# Altium project HUB_USB_3.0.PrjPcb (part 1 of 3)
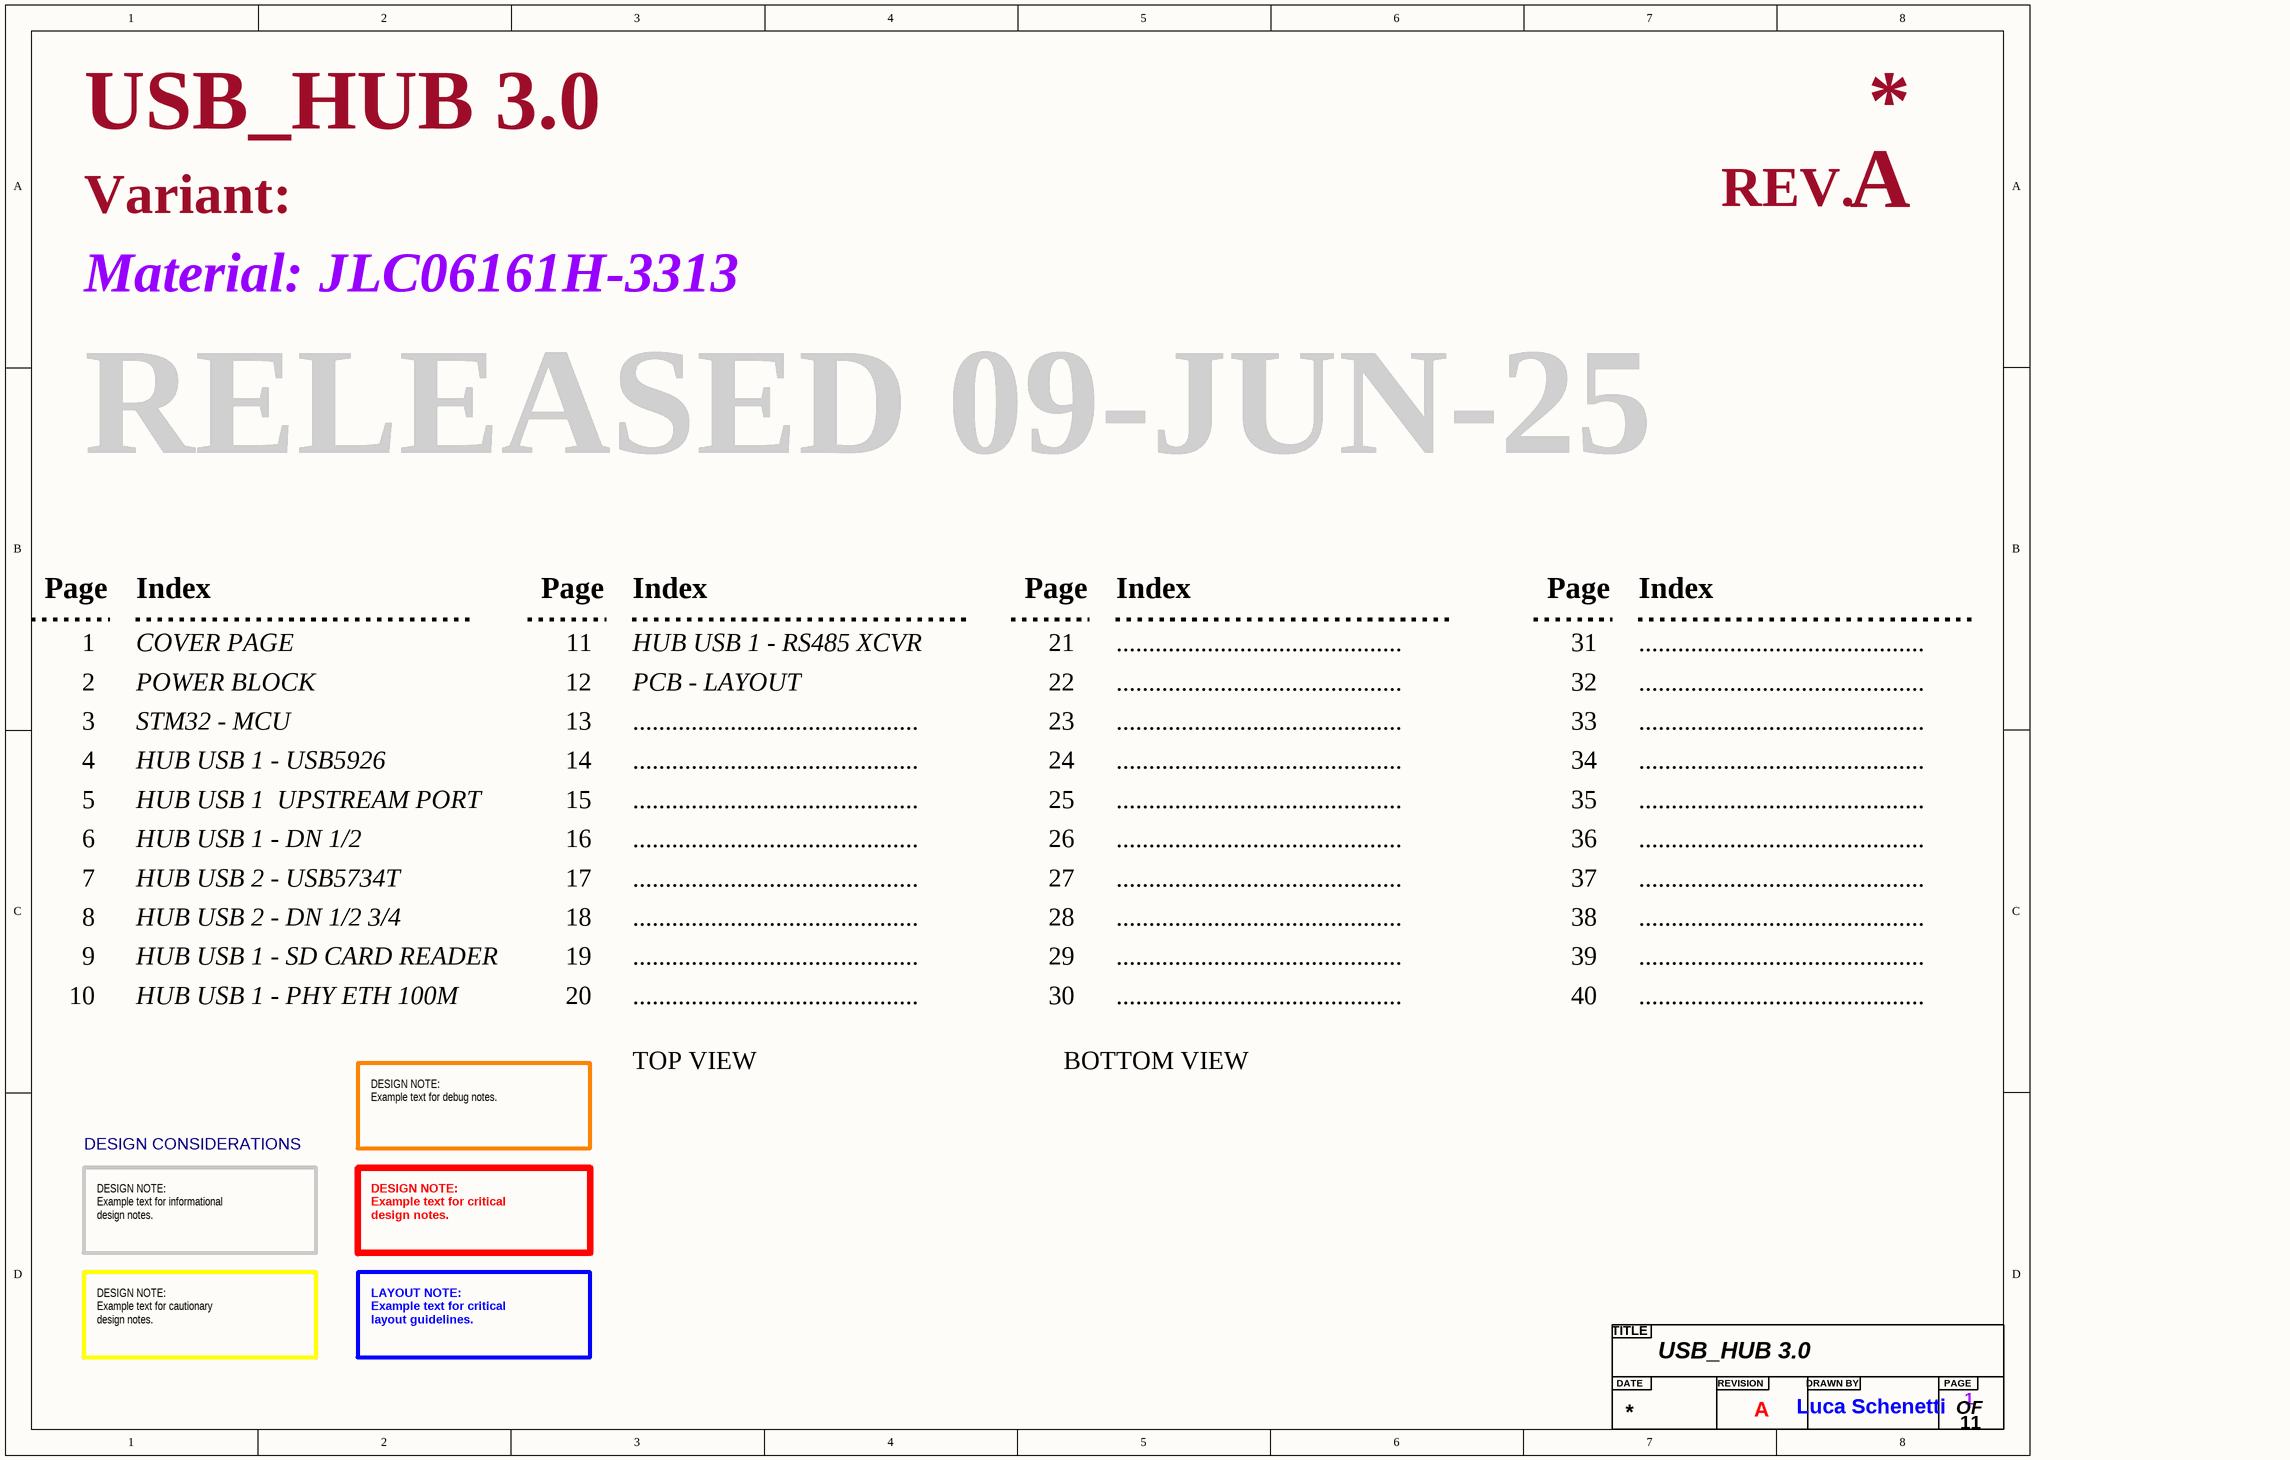
[diagram p0: COVER PAGE.SchDoc]
11 sheets, 545 parts. Net scope: flat (ports and power ports of the same name join across sheets).
Board file: PCB - LAYOUT.PcbDoc
Sheets:
  COVER PAGE.SchDoc
  PWR.SchDoc
  MCU.SchDoc
  USB_HUB1.SchDoc
  USB_HUB1 UP PORT0.SchDoc
  USB_HUB1 DN PORT 1_2.SchDoc
  USB_HUB1 DN PORT 3.SchDoc
  USB_HUB2 DN PORT.SchDoc
  USB_HUB1 DN PORT 4.SchDoc
  USB_HUB1 DN PORT 5.SchDoc
  USB_HUB1 DN PORT 6.SchDoc

## Sheet COVER PAGE.SchDoc: USB_HUB 3.0
size A3; DrawnBy: Luca Schenetti; Engineer: Luca Schenetti; Revision: A; SheetNumber: 1; SheetTotal: 11; Material: JLC06161H-3313

### Parts
(Parts that share a designator on the sheet are numbered #1, #2 ... from top to bottom, then left to right.)
?#1  Title  (value not drawn)  (graphical)

### Notes on the sheet
- Variant:
- REV.
- Material:
- RELEASED 09-JUN-25
- Page
- Index
- 1
- 2
- COVER PAGE
- POWER BLOCK
- 11
- 12
- PCB - LAYOUT
- HUB USB 1 - RS485 XCVR
- 21
- 22
- ............................................
- 31
- 32
- 3
- STM32 - MCU
- 13
- 23
- 33
- 4
- 5
- HUB USB 1 - USB5926
- HUB USB 1  UPSTREAM PORT
- 14
- 15
- 24
- 25
- 34
- 35
- 6
- 7
- HUB USB 2 - USB5734T
- HUB USB 1 - DN 1/2
- 16
- 17
- 26
- 27
- 36
- 37
- 8
- HUB USB 2 - DN 1/2 3/4
- 18
- 28
- 38
- 9
- 10
- HUB USB 1 - SD CARD READER
- HUB USB 1 - PHY ETH 100M
- 19
- 20
- 29
- 30
- 39
- 40
- TOP VIEW
- BOTTOM VIEW
- DESIGN CONSIDERATIONS
- DESIGN NOTE:
  Example text for debug notes.
- DESIGN NOTE:
  Example text for informational
  design notes.
- DESIGN NOTE:
  Example text for critical
  design notes.
- DESIGN NOTE:
  Example text for cautionary
  design notes.
- LAYOUT NOTE:
  Example text for critical
  layout guidelines.
- (in symbol Title) TITLE; DATE; REVISION; DRAWN BY; PAGE; OF

## Sheet PWR.SchDoc: USB_HUB 3.0
size A1; DrawnBy: Luca Schenetti; Revision: A; SheetNumber: 2; SheetTotal: 10
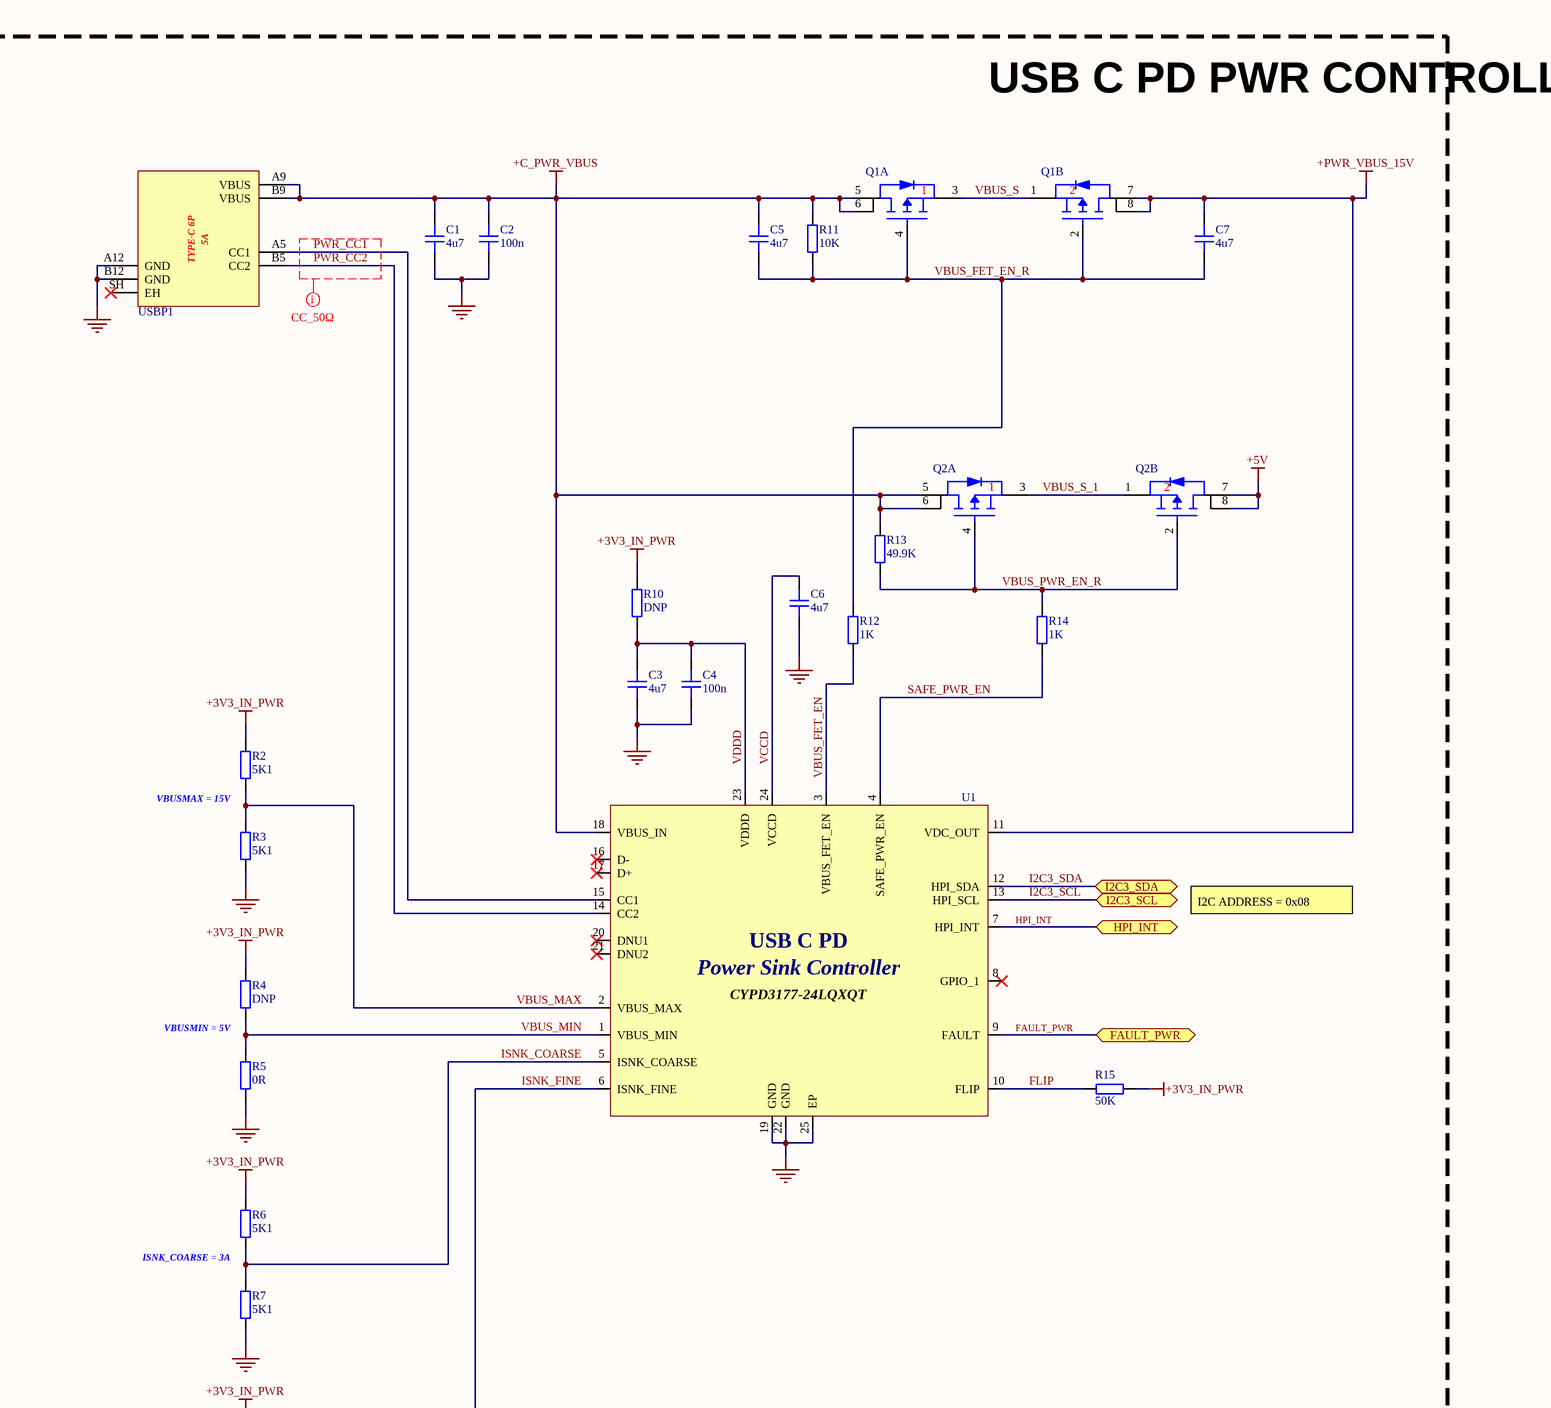
[diagram p1: PWR.SchDoc, top left]
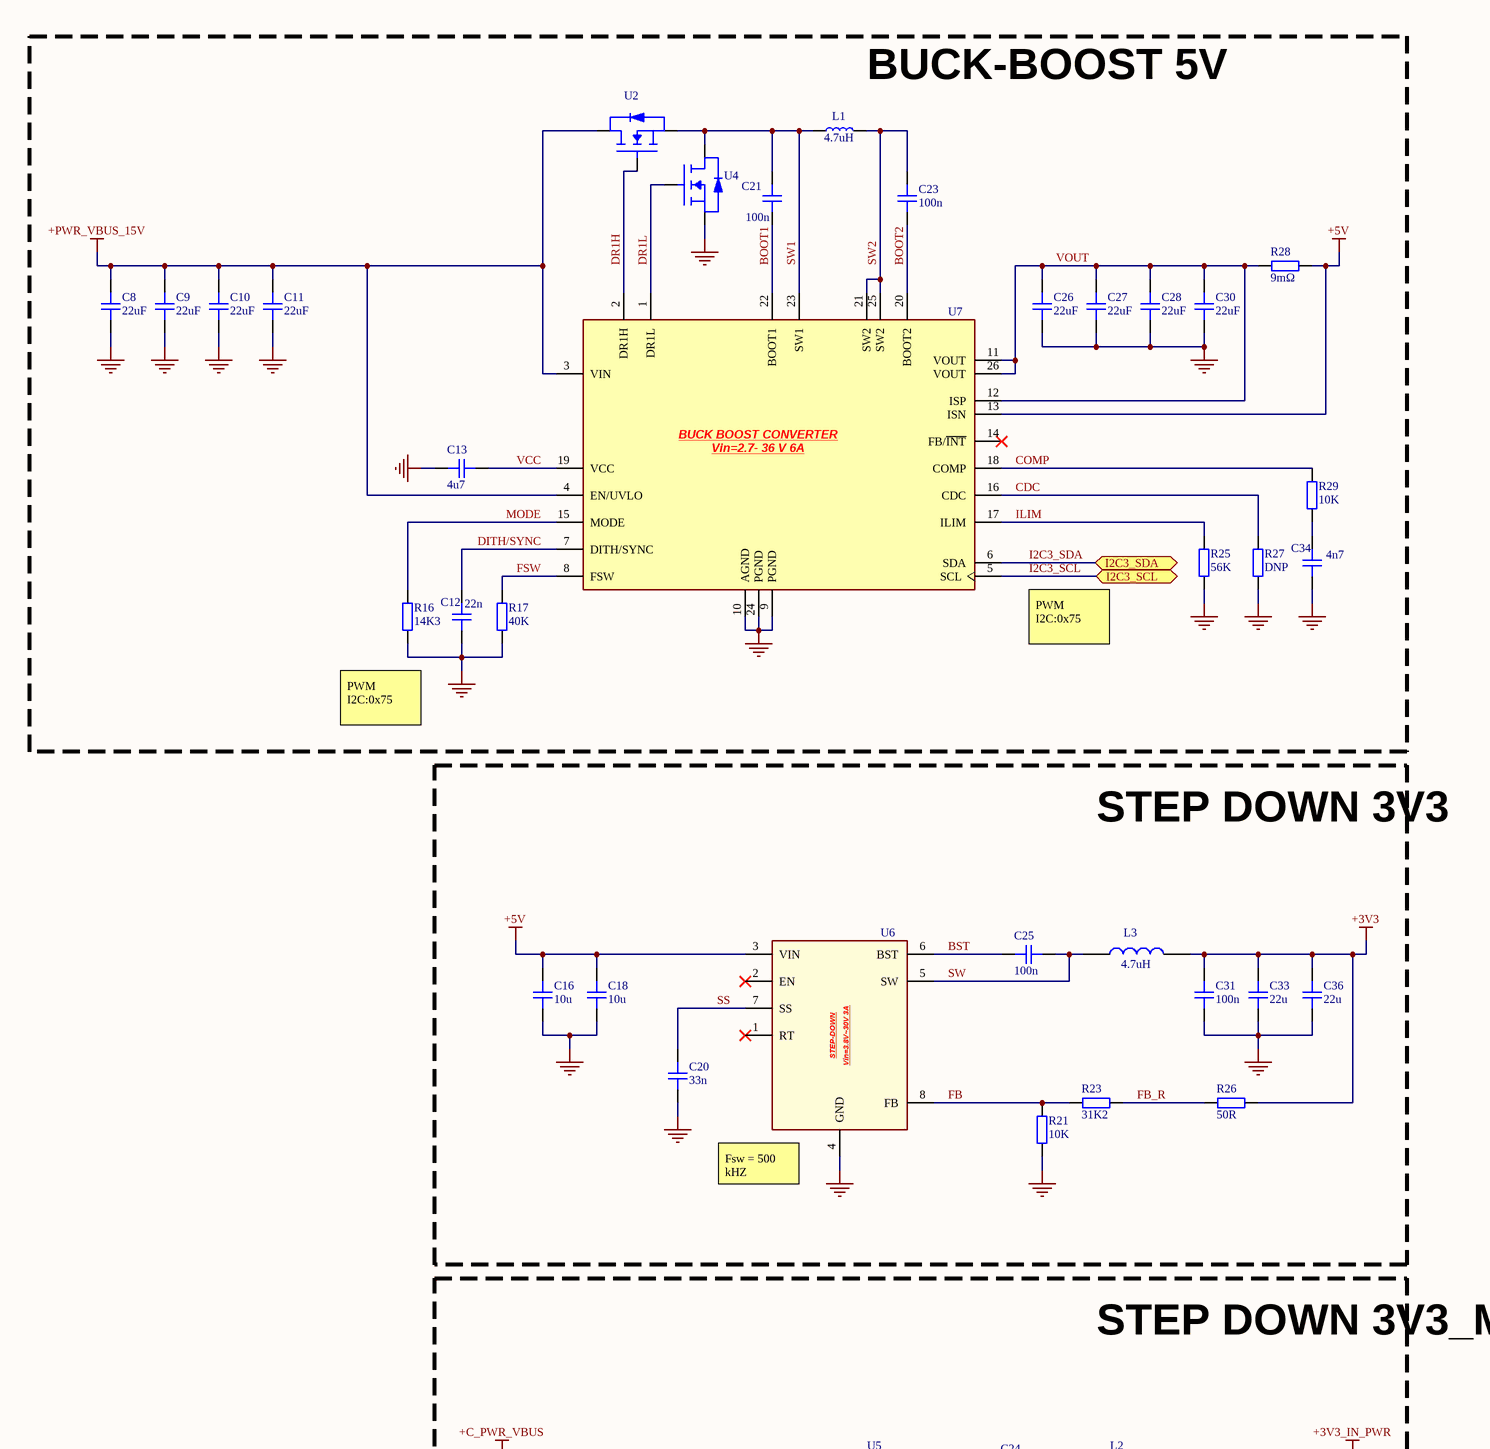
[diagram p2: PWR.SchDoc, top right]
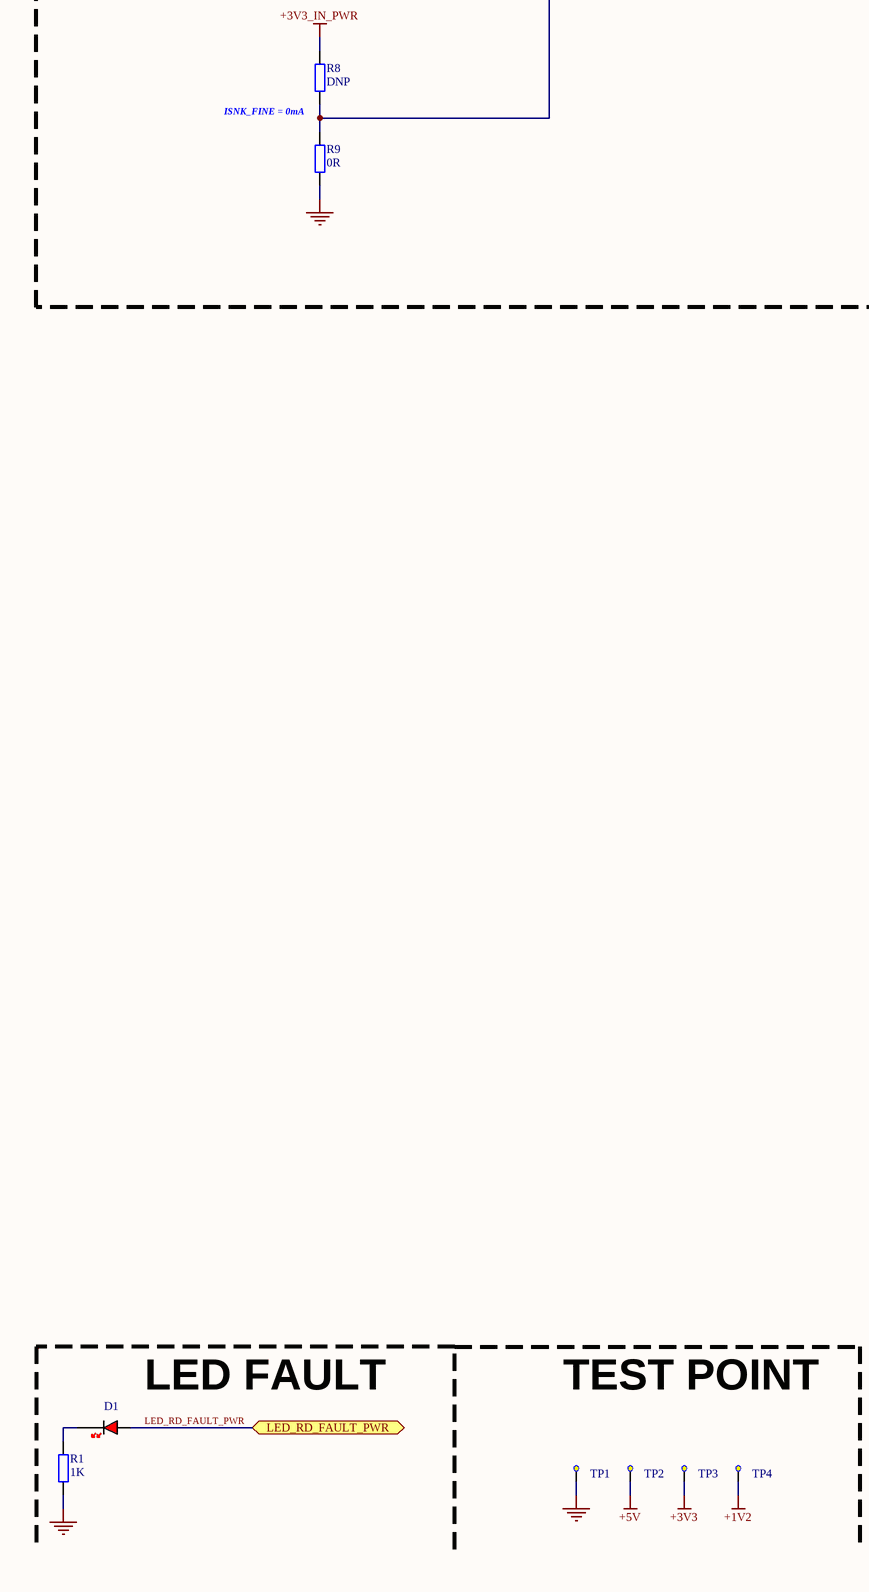
[diagram p3: PWR.SchDoc, bottom left]
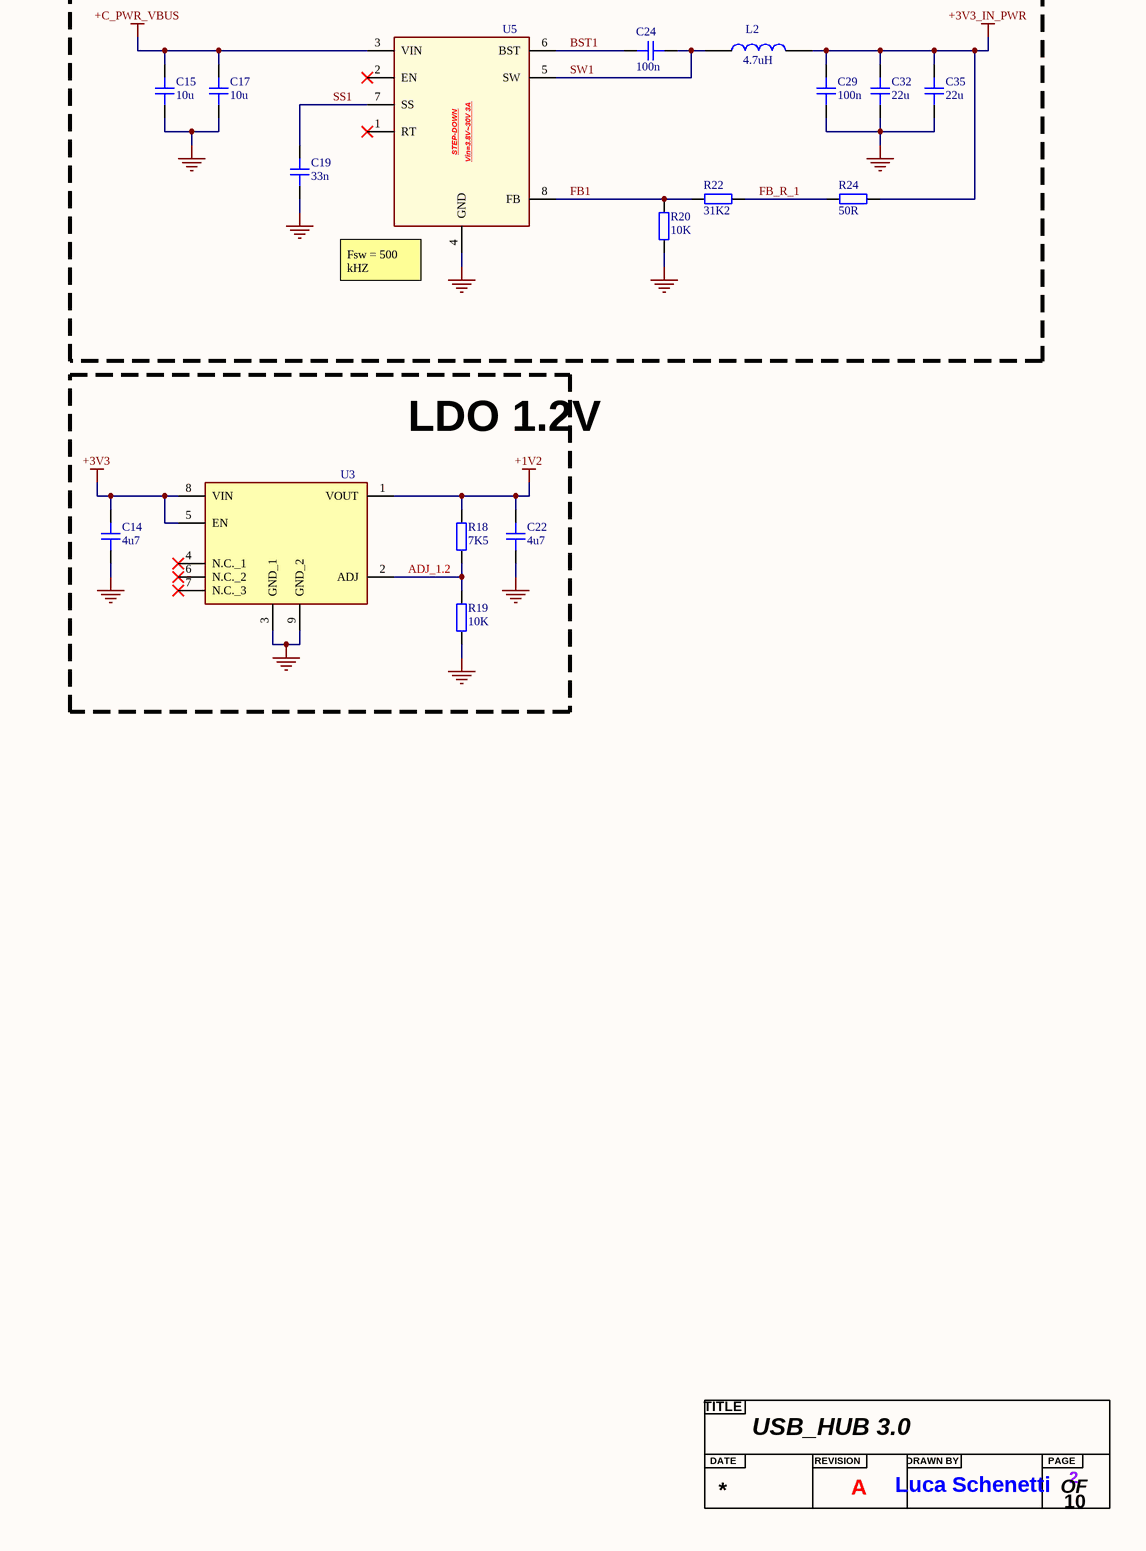
[diagram p4: PWR.SchDoc, bottom right]

### Parts
(Parts that share a designator on the sheet are numbered #1, #2 ... from top to bottom, then left to right.)
?#2  Title  (value not drawn)  (graphical)
C1  4u7  [CAP_0805]
C2  100n  [CAP_0603]
C3  4u7  [CAP_0603]
C4  100n  [CAP_0603]
C5  4u7  [CAP_0805]
C6  4u7  [CAP_0603]
C7  4u7  [CAP_0805]
C8  22uF  [CAP_0805]
C9  22uF  [CAP_0805]
C10  22uF  [CAP_0805]
C11  22uF  [CAP_0805]
C12  22n  [CAP_0603]
C13  4u7  [CAP_0603]
C14  4u7  [CAP_0603]
C15  10u  [CAP_0805]
C16  10u  [CAP_0805]
C17  10u  [CAP_0805]
C18  10u  [CAP_0805]
C19  33n  [CAP_0603]
C20  33n  [CAP_0603]
C21  100n  [CAP_0603]
C22  4u7  [CAP_0603]
C23  100n  [CAP_0603]
C24  100n  [CAP_0603]
C25  100n  [CAP_0603]
C26  22uF  [CAP_0805]
C27  22uF  [CAP_0805]
C28  22uF  [CAP_0805]
C29  100n  [CAP_0603]
C30  22uF  [CAP_0805]
C31  100n  [CAP_0603]
C32  22u  [CAP_0603]
C33  22u  [CAP_0603]
C34  4n7  [CAP_0603]
C35  22u  [CAP_0603]
C36  22u  [CAP_0603]
D1  RED  [LED_0603_RED]  (value not drawn)
L1  4.7uH  [XR0850-4R7M]
L2  4.7uH  [FXL0530-4R7-M]
L3  4.7uH  [FXL0530-4R7-M]
Q1  AO4805  [SOIC-8]  (value not drawn)  (parts A,B of 2)
Q2  AO4805  [SOIC-8]  (value not drawn)  (parts A,B of 2)
R1  1K  [RES_0402]
R2  5K1  [RES_0603]
R3  5K1  [RES_0603]
R4  DNP  [RES_0603]  (no BOM)
R5  0R  [RES_0603]
R6  5K1  [RES_0603]
R7  5K1  [RES_0603]
R8  DNP  [RES_0603]  (no BOM)
R9  0R  [RES_0603]
R10  DNP  [RES_0603]  (no BOM)
R11  10K  [RES_0603]
R12  1K  [RES_0603]
R13  49.9K  [RES_0603]
R14  1K  [RES_0603]
R15  50K  [RES_0603]
R16  14K3  [RES_0603]
R17  40K  [RES_0603]
R18  7K5  [RES_0603]
R19  10K  [RES_0603]
R20  10K  [RES_0603]
R21  10K  [RES_0603]
R22  31K2  [RES_0603]
R23  31K2  [RES_0603]
R24  50R  [RES_0603]
R25  56K  [RES_0603]
R26  50R  [RES_0603]
R27  DNP  [RES_0603]  (no BOM)
R28  9mΩ  [RES_1206]
R29  10K  [RES_0603]
TP1  Test Point  [Test Point]  (value not drawn)
TP2  Test Point  [Test Point]  (value not drawn)
TP3  Test Point  [Test Point]  (value not drawn)
TP4  Test Point  [Test Point]  (value not drawn)
U1  Power Sink Controller  [CYPD3177-24LQXQT]  (value not drawn)
U2  Mosfet N-Channel  Vgs=20V Id=48A  [AON6220]  (value not drawn)
U3  LDO ADJ 2A  [MD7672B50SF4]  (value not drawn)
U4  Mosfet N-Channel  Vgs=20V Id=48A  [AON6220]  (value not drawn)
U5  Step Down Converter 3A 3.8V~30V  [TPS62933DRLR]  (value not drawn)
U6  Step Down Converter 3A 3.8V~30V  [TPS62933DRLR]  (value not drawn)
U7  Buck-Boost Converter 6.35 A  [TPS55288RPMR]  (value not drawn)
USBP1  USB Type-C 5A 6P  [USB-TYPE-C-009]  (value not drawn)

### Blocks framed on the sheet
USB C PD PWR CONTROLLER: C1-C7 Q1 Q2 R2-R15 U1 USBP1
BUCK-BOOST 5V: C8-C13 C21 C23 C26-C28 C30 C34 L1 R16 R17 R25 R27-R29 U2 U4 U7
STEP DOWN 3V3: C16 C18 C20 C25 C31 C33 C36 L3 R21 R23 R26 U6
STEP DOWN 3V3_MCU: C15 C17 C19 C24 C29 C32 C35 L2 R20 R22 R24 U5
LDO 1.2V: C14 C22 R18 R19 U3

### Ports
FAULT_PWR (bidir, see MCU[2D]), HPI_INT (bidir, see MCU[2C]), I2C3_SCL (bidir, see MCU[2C], PWR[4B], USB_HUB1 DN PORT 1_2[5B], USB_HUB1 DN PORT 1_2[5D], USB_HUB1 UP PORT0[5B]), I2C3_SCL (bidir, see MCU[2C], PWR[11A], USB_HUB1 DN PORT 1_2[5B], USB_HUB1 DN PORT 1_2[5D], USB_HUB1 UP PORT0[5B]), I2C3_SDA (bidir, see MCU[4C], PWR[4B], USB_HUB1 DN PORT 1_2[5B], USB_HUB1 DN PORT 1_2[5D], USB_HUB1 UP PORT0[5B]), I2C3_SDA (bidir, see MCU[4C], PWR[11A], USB_HUB1 DN PORT 1_2[5B], USB_HUB1 DN PORT 1_2[5D], USB_HUB1 UP PORT0[5B]), LED_RD_FAULT_PWR (bidir, see MCU[1D])

### Nets
+1V2: C22.2 R18.2 TP4.1(Test_Point) U3.1(VOUT)
+3V3: C14.2 C31.1 C33.2 C36.2 L3.2 R26.1 TP3.1(Test_Point) U3.5(EN) U3.8(VIN)
+3V3_IN_PWR: C29.1 C32.2 C35.2 L2.2 R2.2 R4.2 R6.2 R8.2 R10.2 R15.2 R24.1
+5V: C16.2 C18.2 Q2.7(D2) Q2.8(D2) R28.2 TP2.1(Test_Point) U6.3(VIN) U7.13(ISN)
+C_PWR_VBUS: C1.2 C2.2 C5.2 C15.2 C17.2 Q1.5(D1) Q1.6(D1) Q2.5(D1) Q2.6(D1) R11.2 R13.2 U1.18(VBUS_IN) U5.3(VIN) USBP1.A9(VBUS) USBP1.B9(VBUS)
+PWR_VBUS_15V: C7.2 C8.2 C9.2 C10.2 C11.2 Q1.7(D2) Q1.8(D2) U1.11(VDC_OUT) U2.D U7.3(VIN) U7.4(EN/UVLO)
GND: C1.1 C2.1 C3.1 C4.1 C6.1 C8.1 C9.1 C10.1 C11.1 C12.1 C13.2 C14.1 C15.1 C16.1 C17.1 C18.1 C19.2 C20.2 C22.1 C26.1 C27.1 C28.1 C29.2 C30.1 C31.2 C32.1 C33.1 C34.1 C35.1 C36.1 R1.1 R3.1 R5.1 R7.1 R9.1 R16.1 R17.1 R19.1 R20.1 R21.1 R25.1 R27.1 TP1.1(Test_Point) U1.19(GND) U1.22(GND) U1.25(EP) U3.3(GND_1) U3.9(GND_2) U4.S U5.4(GND) U6.4(GND) U7.9(PGND) U7.10(AGND) U7.24(PGND) USBP1.A12(GND) USBP1.B12(GND)
ADJ_1.2: R18.1 R19.2 U3.2(ADJ)
BOOT1: C21.1 U7.22(BOOT1)
BOOT2: C23.1 U7.20(BOOT2)
BST: C25.2 U6.6(BST)
BST1: C24.2 U5.6(BST)
CDC: R27.2 U7.16(CDC)
COMP: R29.2 U7.18(COMP)
DITH/SYNC: C12.2 U7.7(DITH/SYNC)
DR1H: U2.G U7.2(DR1H)
DR1L: U4.G U7.1(DR1L)
FAULT_PWR: U1.9(FAULT) ; port FAULT_PWR
FB: R21.2 R23.2 U6.8(FB)
FB1: R20.2 R22.2 U5.8(FB)
FB_R: R23.1 R26.2
FB_R_1: R22.1 R24.2
FLIP: R15.1 U1.10(FLIP)
FSW: R17.2 U7.8(FSW)
HPI_INT: U1.7(HPI_INT) ; port HPI_INT
I2C3_SCL: U1.13(HPI_SCL) U7.5(SCL) ; port I2C3_SCL
I2C3_SDA: U1.12(HPI_SDA) U7.6(SDA) ; port I2C3_SDA
ILIM: R25.2 U7.17(ILIM)
ISNK_COARSE: R6.1 R7.2 U1.5(ISNK_COARSE)
ISNK_FINE: R8.1 R9.2 U1.6(ISNK_FINE)
LED_RD_FAULT_PWR: D1.A ; port LED_RD_FAULT_PWR
MODE: R16.2 U7.15(MODE)
PWR_CC1: U1.15(CC1) USBP1.A5(CC1)
PWR_CC2: U1.14(CC2) USBP1.B5(CC2)
SAFE_PWR_EN: R14.1 U1.4(SAFE_PWR_EN)
SS: C20.1 U6.7(SS)
SS1: C19.1 U5.7(SS)
SW: C25.1 L3.1 U6.5(SW)
SW1: C21.2 C24.1 L1.1 L2.1 U2.S U4.D U5.5(SW) U7.23(SW1)
SW2: C23.2 L1.2 U7.21(SW2) U7.25(SW2)
VBUS_FET_EN: R12.1 U1.3(VBUS_FET_EN)
VBUS_FET_EN_R: C5.1 C7.1 Q1.2(G2) Q1.4(G1) R11.1 R12.2
VBUS_MAX: R2.1 R3.2 U1.2(VBUS_MAX)
VBUS_MIN: R4.1 R5.2 U1.1(VBUS_MIN)
VBUS_PWR_EN_R: Q2.2(G2) Q2.4(G1) R13.1 R14.2
VBUS_S: Q1.1(S2) Q1.3(S1)
VBUS_S_1: Q2.1(S2) Q2.3(S1)
VCC: C13.1 U7.19(VCC)
VCCD: C6.2 U1.24(VCCD)
VDDD: C3.2 C4.2 R10.1 U1.23(VDDD)
VOUT: C26.2 C27.2 C28.2 C30.2 R28.1 U7.11(VOUT) U7.12(ISP) U7.26(VOUT)
NetC34_2: C34.2 R29.1
NetD1_K: D1.K R1.2

Not connected (* = marked no-connect by the designer): U1 8(GPIO_1)* 16(D-)* 17(D+)* 20(DNU1)* 21(DNU2)*; U3 4(N.C._1)* 6(N.C._2)* 7(N.C._3)*; U5 1(RT)* 2(EN)*; U6 1(RT)* 2(EN)*; U7 14(FB/~{INT})*; USBP1 SH(EH)*

### Layout directives
net class CC_50Ω: PWR_CC1, PWR_CC2

### Notes on the sheet
- PWM
  I2C:0x75
- VBUSMAX = 15V
- I2C ADDRESS = 0x08
- VBUSMIN = 5V
- (near U6) Fsw = 500 kHZ
- ISNK_COARSE = 3A
- ISNK_FINE = 0mA
- (near U5) Fsw = 500 kHZ
- (near D1) LED FAULT
- TEST POINT
- (in symbol CYPD3177-24LQXQT) USB C PD
- (in symbol Title) TITLE; DATE; REVISION; DRAWN BY; PAGE; OF
- (in symbol TPS55288RPMR) BUCK BOOST CONVERTER; Vin=2.7- 36 V 6A
- (in symbol TPS62933DRLR) STEP-DOWN; Vin=3.8V~30V 3A
- (in symbol USB-TYPE-C-009) TYPE-C 6P; 5A

### Library data of the parts
C1 C5 C7 = CAP_0805: [C1779]; Manufacturer: *; Manufacturer Part Number: *; Distributor Link: *; LCSC: *; Rating: *; Dielectric: *
C2 C4 C21 C23 = CAP_0603: [C14663]; Manufacturer: *; Manufacturer Part Number: *; Distributor Link: *; LCSC: *; Rating: *; Dielectric: *
C3 C13 C14 C22 = CAP_0603: [C19666]; Manufacturer: *; Manufacturer Part Number: *; Distributor Link: *; LCSC: *; Rating: *; Dielectric: *
C6 = CAP_0603: [C69335]; Manufacturer: *; Manufacturer Part Number: *; Distributor Link: *; LCSC: *; Rating: *; Dielectric: *
C8-C11 C26-C28 C30 = CAP_0805: [C45783]; Manufacturer: *; Manufacturer Part Number: *; Distributor Link: *; LCSC: *; Rating: *; Dielectric: *
C12 = CAP_0603: [C21122]; Manufacturer: *; Manufacturer Part Number: *; Distributor Link: *; LCSC: *; Rating: *; Dielectric: *
C15-C18 = CAP_0805: Capacitor SMD 0805[C440198]; Manufacturer: *; Manufacturer Part Number: *; Distributor Link: *; LCSC: *; Rating: *; Dielectric: *
C19 C20 = CAP_0603: [C21117]; Manufacturer: *; Manufacturer Part Number: *; Distributor Link: *; LCSC: *; Rating: *; Dielectric: *
C24 C25 C29 C31 = CAP_0603: Capacitor SMD 0603 [C14663]; Manufacturer: *; Manufacturer Part Number: *; Distributor Link: *; LCSC: *; Rating: *; Dielectric: *
C32 C33 C35 C36 = CAP_0603: Capacitor SMD 0603 [C59461]; Manufacturer: *; Manufacturer Part Number: *; Distributor Link: *; LCSC: *; Rating: *; Dielectric: *
C34 = CAP_0603: [C53987]; Manufacturer: *; Manufacturer Part Number: *; Distributor Link: *; LCSC: *; Rating: *; Dielectric: *
D1 = LED_0603_RED: LED 0603 RED SMD[C2926776]
L1 = XR0850-4R7M: [C7498934]
L2 L3 = FXL0530-4R7-M: [C177246]
Q1 Q2 = AO4805: [C5224317]; Manufacturer: Alpha & Omega Semicon; Manufacturer Part Number: AO4805; LCSC: C38943
R1 = RES_0402: [C11702]; Manufacturer: *; Manufacturer Part Number: *; Distributor Link: *; LCSC: *
R2 R3 R6 R7 = RES_0603: [C23186]; Manufacturer: *; Manufacturer Part Number: *; Distributor Link: *; LCSC: *
R4 R8 R10 R27 = RES_0603: Manufacturer: *; Manufacturer Part Number: *; Distributor Link: *; LCSC: *
R5 R9 = RES_0603: [C21189]; Manufacturer: *; Manufacturer Part Number: *; Distributor Link: *; LCSC: *
R11 R19-R21 R29 = RES_0603: [C25804]; Manufacturer: *; Manufacturer Part Number: *; Distributor Link: *; LCSC: *
R12 R14 = RES_0603: [C21190]; Manufacturer: *; Manufacturer Part Number: *; Distributor Link: *; LCSC: *
R13 = RES_0603: [C23184]; Manufacturer: *; Manufacturer Part Number: *; Distributor Link: *; LCSC: *
R15 = RES_0603: [C861451]; Manufacturer: *; Manufacturer Part Number: *; Distributor Link: *; LCSC: *
R16 = RES_0603: [C2933145]; Manufacturer: *; Manufacturer Part Number: *; Distributor Link: *; LCSC: *
R17 = RES_0603: [C3016445]; Manufacturer: *; Manufacturer Part Number: *; Distributor Link: *; LCSC: *
R18 = RES_0603: [C23234]; Manufacturer: *; Manufacturer Part Number: *; Distributor Link: *; LCSC: *
R22 R23 = RES_0603: [C863036]; Manufacturer: *; Manufacturer Part Number: *; Distributor Link: *; LCSC: *
R24 R26 = RES_0603: [C849792]; Manufacturer: *; Manufacturer Part Number: *; Distributor Link: *; LCSC: *
R25 = RES_0603: [C23206]; Manufacturer: *; Manufacturer Part Number: *; Distributor Link: *; LCSC: *
R28 = RES_1206: [C2904216]; Manufacturer: *; Manufacturer Part Number: *; Distributor Link: *; LCSC: *
U1 = CYPD3177-24LQXQT: [C5904158]; Manufacturer: Cypress Semicon; Manufacturer Part Number: CYPD3177-24LQXQ; Distributor Link: https://www.lcsc.com/product-detail/USB-ICs_Cypress-Semicon-CYPD3177-24LQXQ_C2959321.html
U2 U4 = AON6220: [C2997886]
U3 = MD7672B50SF4: [C920526]
U5 U6 = TPS62933DRLR: [C3200405]
U7 = TPS55288RPMR: [C2864583]
USBP1 = USB-TYPE-C-009: [C2927029]
TP1-TP4 = Test Point: Value: Test Point

## Sheet MCU.SchDoc: USB_HUB 3.0
size A3; DrawnBy: Luca Schenetti; Revision: A; SheetNumber: 3; SheetTotal: 10
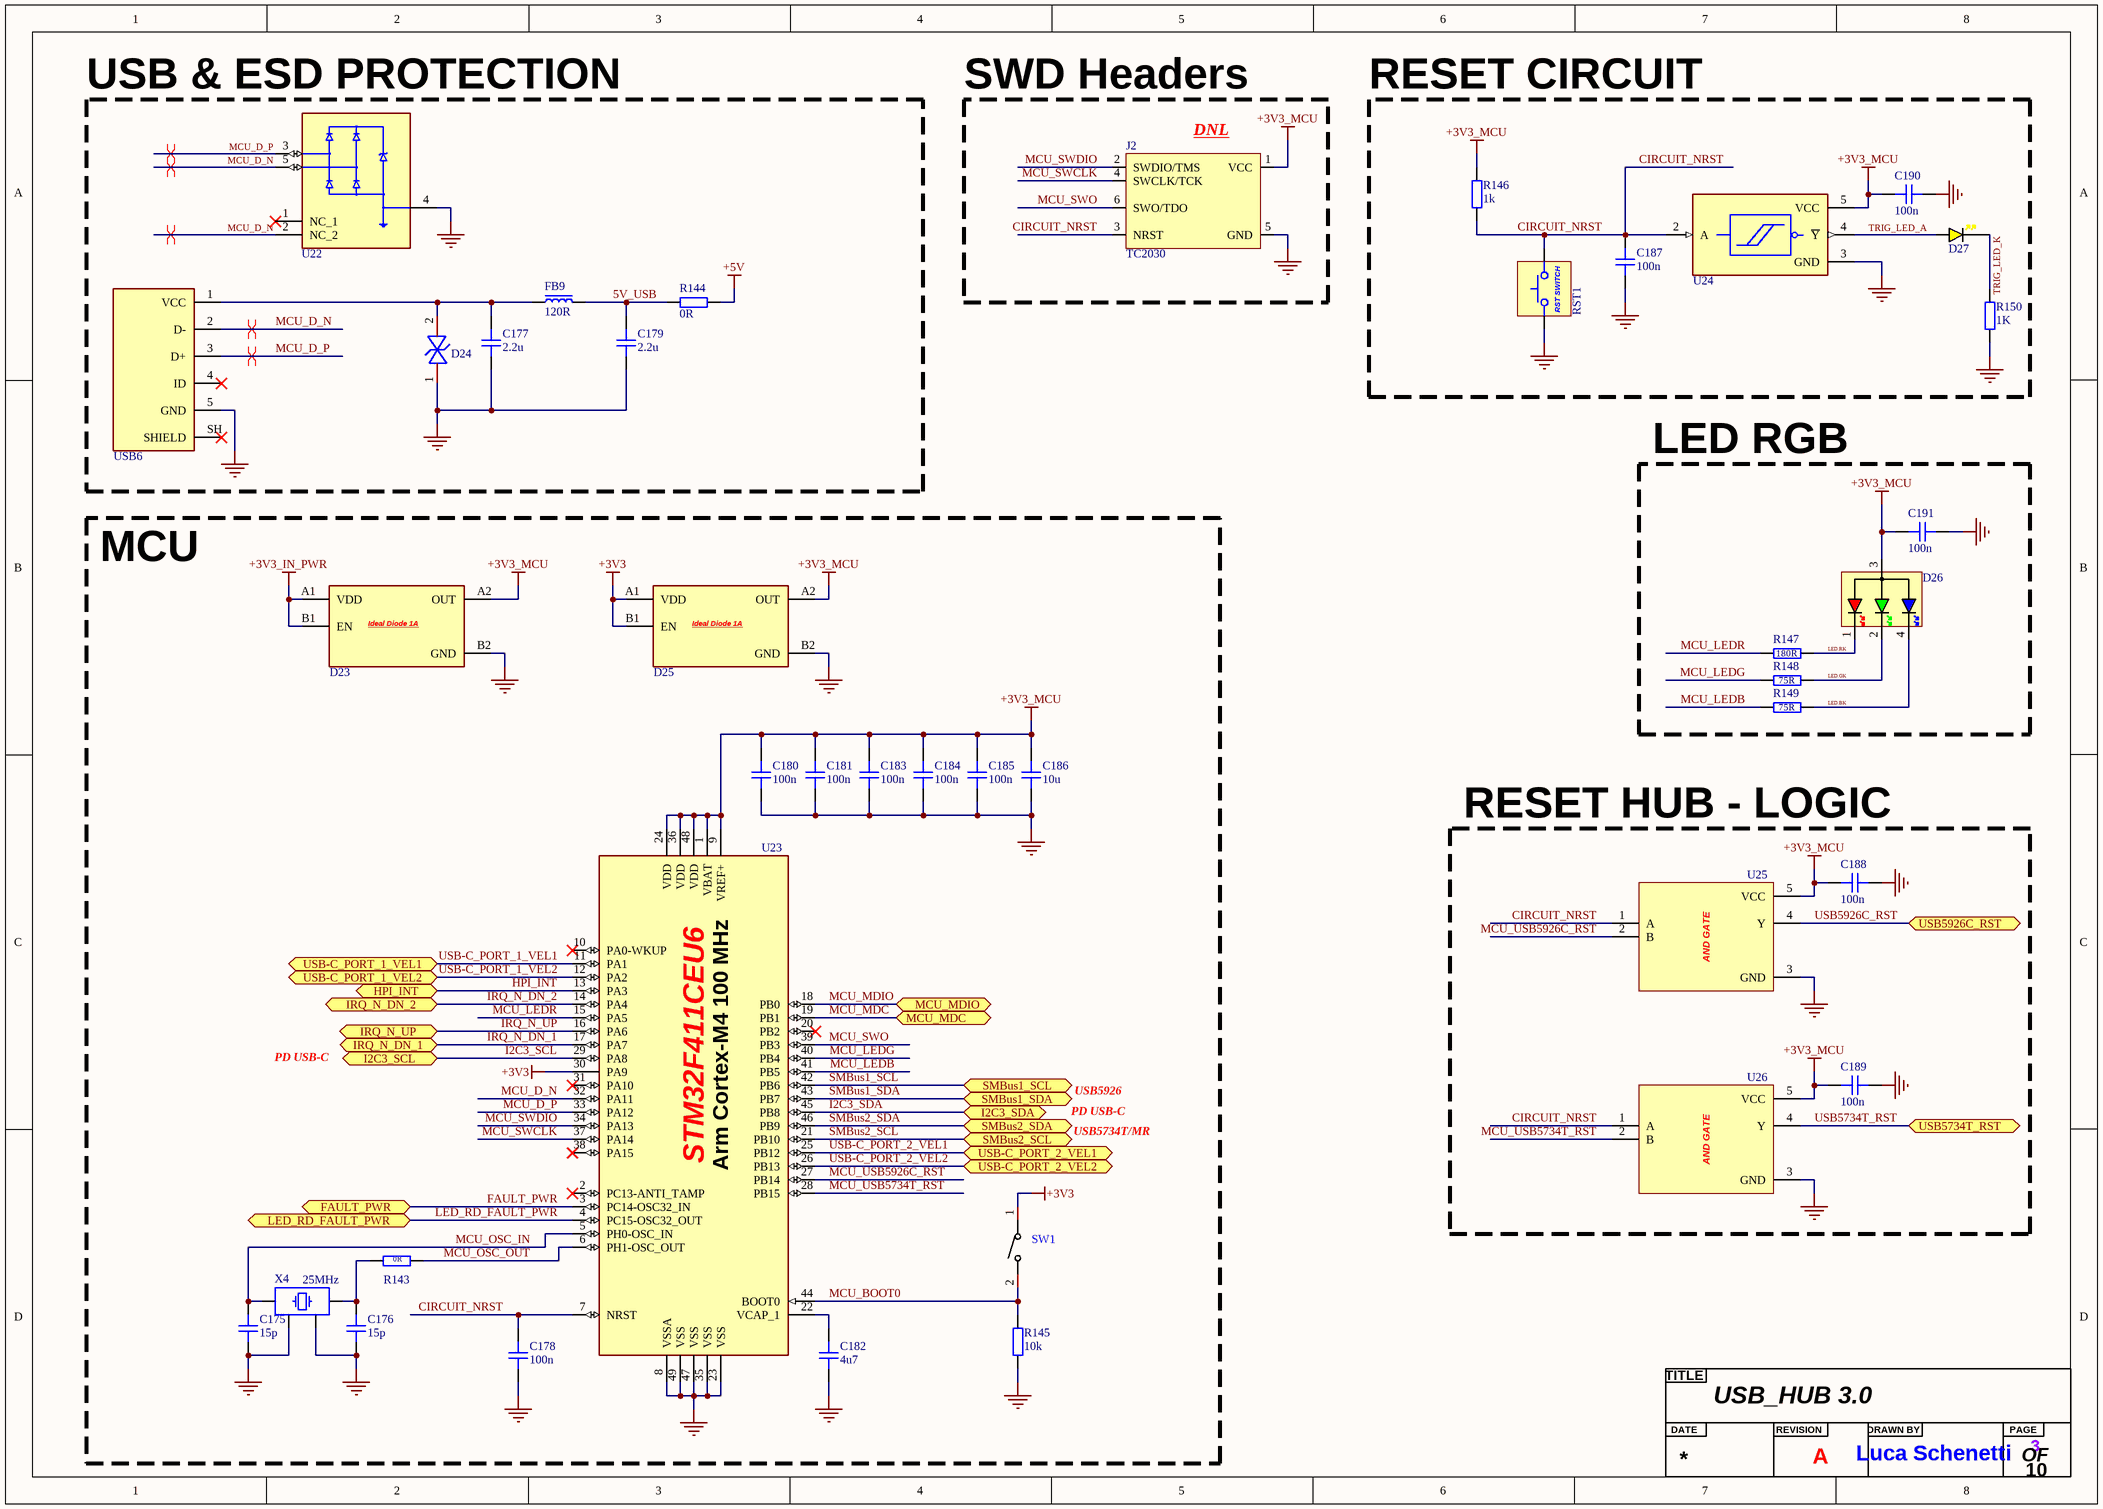
[diagram p5: MCU.SchDoc]

### Parts
(Parts that share a designator on the sheet are numbered #1, #2 ... from top to bottom, then left to right.)
?#3  Title  (value not drawn)  (graphical)
C175  15p  [CAP_0402]
C176  15p  [CAP_0402]
C177  2.2u  [CAP_0603]
C178  100n  [CAP_0603]
C179  2.2u  [CAP_0603]
C180  100n  [CAP_0603]
C181  100n  [CAP_0603]
C182  4u7  [CAP_0603]
C183  100n  [CAP_0603]
C184  100n  [CAP_0603]
C185  100n  [CAP_0603]
C186  10u  [CAP_0603]
C187  100n  [CAP_0402]
C188  100n  [CAP_0402]
C189  100n  [CAP_0402]
C190  100n  [CAP_0402]
C191  100n  [CAP_0402]
D23  1A Ideal Diode  [MAX40200ANS+T]  (value not drawn)
D24  ESD Protection TVS 6.0V  [SMF6.0CA]  (value not drawn)
D25  1A Ideal Diode  [MAX40200ANS+T]  (value not drawn)
D26  RGB_LED  [XL-2012RGBC]  (value not drawn)
D27  YELLOW  [LED_0603_YELLOW]  (value not drawn)
FB9  120R  [FB_0603]
J2  TC2030  [TC2030-FP]  (no BOM)
R143  0R  [RES_0402]
R144  0R  [RES_0603]
R145  10k  [RES_0603]
R146  1k  [RES_0402]
R147  180R  [RES_0603]
R148  75R  [RES_0603]
R149  75R  [RES_0603]
R150  1K  [RES_0402]
RST1  RST_SWITCH_STM32  [RST_SWITCH]  (value not drawn)
SW1  TS-1088-AR02016  [TS-1088-AR02016]  (value not drawn)
U22  TVS USB 2.0 ±25-kV  [TPD2E2U06DRLR]  (value not drawn)
U23  ARM® Cortex®-M4 STM32F4  [STM32F411CEU6]  (value not drawn)
U24  Schmitt Trigger 1.65V~5.5V  [74LVC1G14GW,125]  (value not drawn)
U25  AND GATE  [SN74LVC1G08DBVR]  (value not drawn)
U26  AND GATE  [SN74LVC1G08DBVR]  (value not drawn)
USB6  USB 2.0 MICRO B  [10118194-0001LF]  (value not drawn)
X4  25MHz  [XTAL_3225]

### Blocks framed on the sheet
USB & ESD PROTECTION: C177 C179 D24 FB9 R144 U22 USB6
SWD Headers: J2
RESET CIRCUIT: C187 C190 D27 R146 R150 RST1 U24
LED RGB: C191 D26 R147-R149
MCU: C175 C176 C178 C180-C186 D23 D25 R143 R145 SW1 U23 X4
RESET HUB - LOGIC: C188 C189 U25 U26

### Ports
FAULT_PWR (bidir, see PWR[4B]), HPI_INT (bidir, see PWR[4B]), I2C3_SCL (bidir, see PWR[4B], PWR[11A], USB_HUB1 DN PORT 1_2[5B], USB_HUB1 DN PORT 1_2[5D], USB_HUB1 UP PORT0[5B]), I2C3_SDA (bidir, see PWR[4B], PWR[11A], USB_HUB1 DN PORT 1_2[5B], USB_HUB1 DN PORT 1_2[5D], USB_HUB1 UP PORT0[5B]), IRQ_N_DN_1 (bidir, see USB_HUB1 DN PORT 1_2[5B]), IRQ_N_DN_2 (bidir, see USB_HUB1 DN PORT 1_2[5D]), IRQ_N_UP (bidir, see USB_HUB1 UP PORT0[5B]), LED_RD_FAULT_PWR (bidir, see PWR[1D]), MCU_MDC (bidir, see USB_HUB1 DN PORT 5[2B]), MCU_MDIO (bidir, see USB_HUB1 DN PORT 5[2B]), SMBus1_SCL (bidir, see USB_HUB1[3C]), SMBus1_SDA (bidir, see USB_HUB1[3C]), SMBus2_SCL (bidir, see USB_HUB1 DN PORT 3[1C]), SMBus2_SDA (bidir, see USB_HUB1 DN PORT 3[1C]), USB5734T_RST (bidir, see USB_HUB1 DN PORT 3[2D]), USB5926C_RST (bidir, see USB_HUB1 DN PORT 1_2[5B], USB_HUB1 DN PORT 1_2[5D], USB_HUB1 DN PORT 5[3D], USB_HUB1 DN PORT 6[1C], USB_HUB1 UP PORT0[5C], USB_HUB1[3C]), USB-C_PORT_1_VEL1 (bidir, see USB_HUB1 DN PORT 1_2[3B]), USB-C_PORT_1_VEL2 (bidir, see USB_HUB1 DN PORT 1_2[3B]), USB-C_PORT_2_VEL1 (bidir, see USB_HUB1 DN PORT 1_2[3D]), USB-C_PORT_2_VEL2 (bidir, see USB_HUB1 DN PORT 1_2[3D])

### Nets
+3V3: D25.A1(VDD) D25.B1(EN) SW1.1 U23.30(PA9)
+3V3_IN_PWR: D23.A1(VDD) D23.B1(EN)
+3V3_MCU: C180.2 C181.2 C183.2 C184.2 C185.2 C186.2 C188.2 C189.2 C190.2 C191.2 D23.A2(OUT) D25.A2(OUT) D26.3(AC) J2.1(VCC) R146.2 U23.1(VBAT) U23.9(VREF+) U23.24(VDD) U23.36(VDD) U23.48(VDD) U24.5(VCC) U25.5(VCC) U26.5(VCC)
+5V: R144.2
GND: C175.1 C176.1 C177.1 C178.1 C179.1 C180.1 C181.1 C182.1 C183.1 C184.1 C185.1 C186.1 C187.1 C188.1 C189.1 C190.1 C191.1 D23.B2(GND) D24.1(C) D25.B2(GND) J2.5(GND) R145.1 R150.1 RST1.1 U22.4(GND) U23.8(VSSA) U23.23(VSS) U23.35(VSS) U23.47(VSS) U23.49(VSS) U24.3(GND) U25.3(GND) U26.3(GND) USB6.5(GND) X4.2 X4.4
5V_USB: C179.2 FB9.2 R144.1
CIRCUIT_NRST: C178.2 C187.2 J2.3(NRST) R146.1 RST1.2 U23.7(NRST) U24.2(A) U25.1(A) U26.1(A)
FAULT_PWR: U23.3(PC14-OSC32_IN) ; port FAULT_PWR
HPI_INT: U23.13(PA3) ; port HPI_INT
I2C3_SCL: U23.29(PA8) ; port I2C3_SCL
I2C3_SDA: U23.45(PB8) ; port I2C3_SDA
IRQ_N_DN_1: U23.17(PA7) ; port IRQ_N_DN_1
IRQ_N_DN_2: U23.14(PA4) ; port IRQ_N_DN_2
IRQ_N_UP: U23.16(PA6) ; port IRQ_N_UP  [project net IRQ_N_1_UP]
LED.BK: D26.4(CB) R149.1
LED.GK: D26.2(CG) R148.1
LED.RK: D26.1(CR) R147.1
LED_RD_FAULT_PWR: U23.4(PC15-OSC32_OUT) ; port LED_RD_FAULT_PWR
MCU_BOOT0: R145.2 SW1.2 U23.44(BOOT0)
MCU_D_N: U22.2(NC_2) U22.5(IO2) U23.32(PA11) USB6.2(D-)
MCU_D_P: U22.3(IO1) U23.33(PA12) USB6.3(D+)
MCU_LEDB: R149.2 U23.41(PB5)
MCU_LEDG: R148.2 U23.40(PB4)
MCU_LEDR: R147.2 U23.15(PA5)
MCU_MDC: U23.19(PB1) ; port MCU_MDC
MCU_MDIO: U23.18(PB0) ; port MCU_MDIO
MCU_OSC_IN: C175.2 U23.5(PH0-OSC_IN) X4.3
MCU_OSC_OUT: R143.2 U23.6(PH1-OSC_OUT)
MCU_SWCLK: J2.4(SWCLK/TCK) U23.37(PA14)
MCU_SWDIO: J2.2(SWDIO/TMS) U23.34(PA13)
MCU_SWO: J2.6(SWO/TDO) U23.39(PB3)
MCU_USB5734T_RST: U23.28(PB15) U26.2(B)
MCU_USB5926C_RST: U23.27(PB14) U25.2(B)
SMBus1_SCL: U23.42(PB6) ; port SMBus1_SCL
SMBus1_SDA: U23.43(PB7) ; port SMBus1_SDA
SMBus2_SCL: U23.21(PB10) ; port SMBus2_SCL
SMBus2_SDA: U23.46(PB9) ; port SMBus2_SDA
TRIG_LED_A: D27.A U24.4(~{Y})
TRIG_LED_K: D27.K R150.2
USB5734T_RST: U26.4(Y) ; port USB5734T_RST
USB5926C_RST: U25.4(Y) ; port USB5926C_RST
USB-C_PORT_1_VEL1: U23.11(PA1) ; port USB-C_PORT_1_VEL1
USB-C_PORT_1_VEL2: U23.12(PA2) ; port USB-C_PORT_1_VEL2
USB-C_PORT_2_VEL1: U23.25(PB12) ; port USB-C_PORT_2_VEL1
USB-C_PORT_2_VEL2: U23.26(PB13) ; port USB-C_PORT_2_VEL2
NetC176_2: C176.2 R143.1 X4.1
NetC177_2: C177.2 D24.2(A) FB9.1 USB6.1(VCC)
NetC182_2: C182.2 U23.22(VCAP_1)

Not connected (* = marked no-connect by the designer): U22 1(NC_1)*; U23 2(PC13-ANTI_TAMP)* 10(PA0-WKUP)* 20(PB2)* 31(PA10)* 38(PA15)*; USB6 4(ID)* SH(SHIELD)*

### Layout directives
differential pair; differential pair class DIFF_USB_90Ω: MCU_D_N, MCU_D_P

### Notes on the sheet
- (near J2) DNL
- PD USB-C
- USB5926
- USB5734T/MR
- (in symbol MAX40200ANS+T) Ideal Diode 1A
- (in symbol RST_SWITCH) RST SWITCH
- (in symbol STM32F411CEU6) Arm Cortex-M4 100 MHz
- (in symbol Title) TITLE; DATE; REVISION; DRAWN BY; PAGE; OF

### Library data of the parts
C175 C176 = CAP_0402: Capacitor SMD 0402 [C1548]; Manufacturer: *; Manufacturer Part Number: *; Distributor Link: *; LCSC: *; Rating: *; Dielectric: *
C177 C179 = CAP_0603: Capacitor SMD 0603 [C23630]; Manufacturer: *; Manufacturer Part Number: *; Distributor Link: *; LCSC: *; Rating: *; Dielectric: *
C178 C180 C181 C183-C185 = CAP_0603: Capacitor SMD 0603 [C14663]; Manufacturer: *; Manufacturer Part Number: *; Distributor Link: *; LCSC: *; Rating: *; Dielectric: *
C182 = CAP_0603: Capacitor SMD 0603 [C19666]; Manufacturer: *; Manufacturer Part Number: *; Distributor Link: *; LCSC: *; Rating: *; Dielectric: *
C186 = CAP_0603: Capacitor SMD 0603 [C96446]; Manufacturer: *; Manufacturer Part Number: *; Distributor Link: *; LCSC: *; Rating: *; Dielectric: *
C187-C191 = CAP_0402: Capacitor SMD 0402 [C1525]; Manufacturer: *; Manufacturer Part Number: *; Distributor Link: *; LCSC: *; Rating: *; Dielectric: *
D23 D25 = MAX40200ANS+T: [C3227637]
D24 = SMF6.0CA: [C2990473]
D26 = RGB_LED_0805: [C965848]
D27 = LED_0603_YELLOW: LED 0603 YELLOW SMD[C72038]
FB9 = FB_0603: Ferrite Bead SMD 0603[C76892]; Manufacturer: *; Manufacturer Part Number: *; Distributor Link: *; LCSC: *
J2 = TC2030: Tag-Connect No-Solder SWD Debug Connector DO NOT PLACE; Manufacturer: Tag-Connect; Manufacturer Part Number: TC2030
R143 = RES_0402: Resistor SMD 0402 [C17168]; Manufacturer: *; Manufacturer Part Number: *; Distributor Link: *; LCSC: *
R144 = RES_0603: [C21189]; Manufacturer: *; Manufacturer Part Number: *; Distributor Link: *; LCSC: *
R145 = RES_0603: Resistor SMD 0603[C25804]; Manufacturer: *; Manufacturer Part Number: *; Distributor Link: *; LCSC: *
R146 R150 = RES_0402: Resistor SMD 0402 [C11702]; Manufacturer: *; Manufacturer Part Number: *; Distributor Link: *; LCSC: *
R147 = RES_0603: [C22828]; Manufacturer: *; Manufacturer Part Number: *; Distributor Link: *; LCSC: *
R148 R149 = RES_0603: [C4275]; Manufacturer: *; Manufacturer Part Number: *; Distributor Link: *; LCSC: *
RST1 = RST_SWITCH: [C720477]
SW1 = TS-1088-AR02016: [C720477]; Manufacturer: XUNPU(讯普); Add into BOM: yes; Circuit: SPST; Actuator Style: Round Button; Operating Force: 160gf; Switch Length: 4mm; Switch Width: 3mm; Switch Height: 2mm; Strike Gundam: 不带; Contact Current: 50mA; Voltage Rating (DC): 12V; Insulation Resistance: 100MΩ; Actuator/Cap Color: Black; Pin Style: SMDSplicing; Mechanical Life: 10万次; Symbol: TS-1088-AR02016; Device: TS-1088-AR02016; Supplier: LCSC; Supplier Part: C720477; Manufacturer Part: TS-1088-AR02016; JLCPCB Part Class: Extended Part; LCSC Part Name: 4*3*2mm 立贴 轻触开关; Supplier Footprint: SMD; Datasheet: https://atta.szlcsc.com/upload/public/pdf/source/20200810/C720475_60D09DD6C54279ADDB2DC25100F1CC11.pdf; Convert to PCB: yes; Mounting Style: Brick nogging; Operating Temperature: -30℃~+80℃
U22 = TPD2E2U06DRLR: [C1972959]
U23 = STM32F411CEU6: [C60420]
U24 = 74LVC1G14GW,125: [C265125]
U25 U26 = SN74LVC1G08DBVR: [C7666]
USB6 = 10118194-0001LF: [C132563]
X4 = TSX-3225_24.0000MF15X-AC: Crystal SMD 24MHz 10PPM 7pF 3225 [C9006]; Manufacturer: Epson; Manufacturer Part Number: TSX-3225 24.0000MF15X-AC

## Sheet USB_HUB1.SchDoc: USB_HUB 3.0
size A2; DrawnBy: Luca Schenetti; Revision: A; SheetNumber: 4; SheetTotal: 10
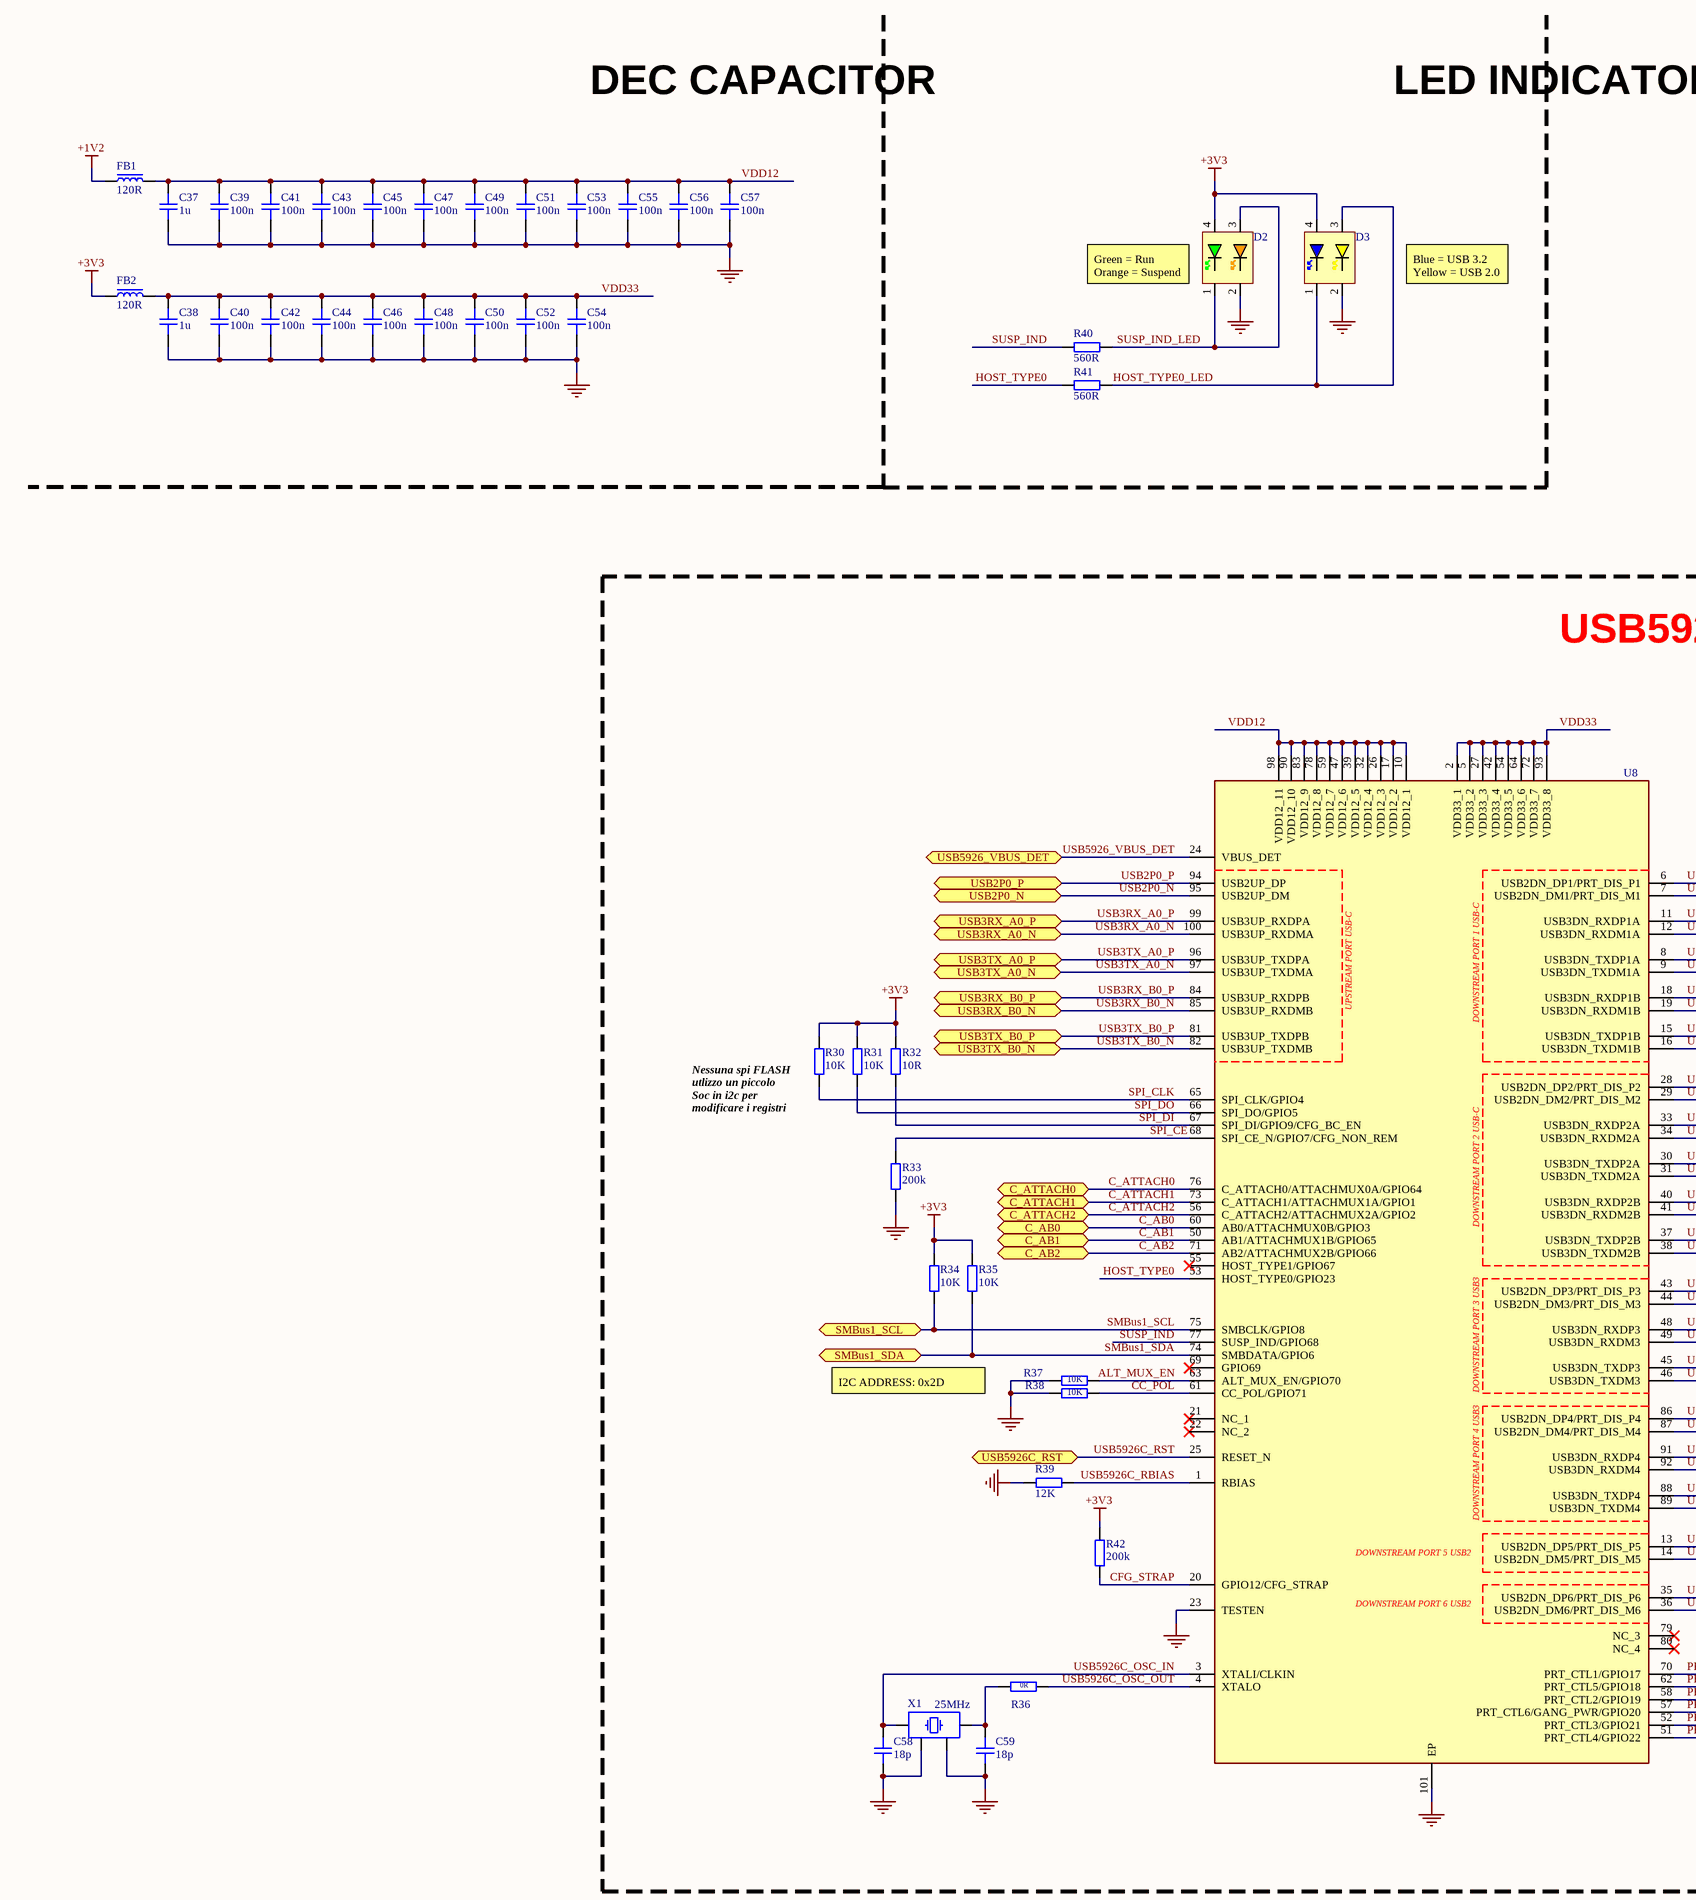
[diagram p6: USB_HUB1.SchDoc, left]
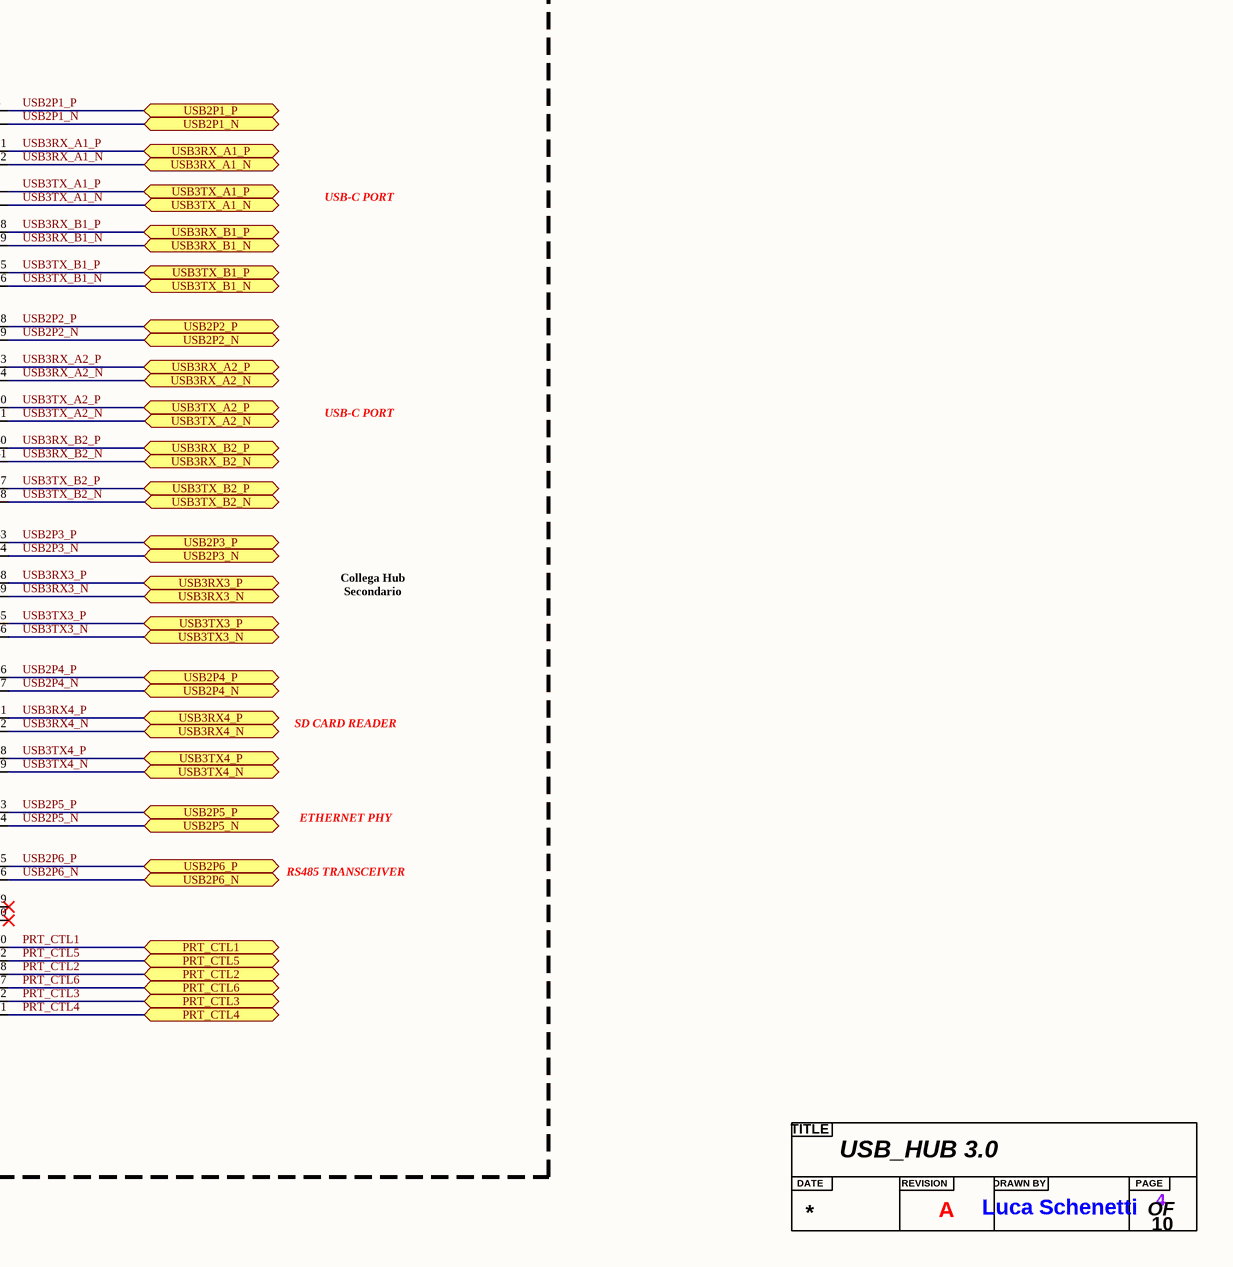
[diagram p7: USB_HUB1.SchDoc, right]

### Parts
(Parts that share a designator on the sheet are numbered #1, #2 ... from top to bottom, then left to right.)
?#4  Title  (value not drawn)  (graphical)
C37  1u  [CAP_0603]
C38  1u  [CAP_0603]
C39  100n  [CAP_0603]
C40  100n  [CAP_0603]
C41  100n  [CAP_0603]
C42  100n  [CAP_0603]
C43  100n  [CAP_0603]
C44  100n  [CAP_0603]
C45  100n  [CAP_0603]
C46  100n  [CAP_0603]
C47  100n  [CAP_0603]
C48  100n  [CAP_0603]
C49  100n  [CAP_0603]
C50  100n  [CAP_0603]
C51  100n  [CAP_0603]
C52  100n  [CAP_0603]
C53  100n  [CAP_0603]
C54  100n  [CAP_0603]
C55  100n  [CAP_0603]
C56  100n  [CAP_0603]
C57  100n  [CAP_0603]
C58  18p  [CAP_0402]
C59  18p  [CAP_0402]
D2  TWO LED Orange Green 0603  [A-SP1962S1GHC-C01-3T]  (value not drawn)
D3  TWO LED Yellow Blue 0603  [A-SP1962Y3B1C-C01-3T]  (value not drawn)
FB1  120R  [FB_0603]
FB2  120R  [FB_0603]
R30  10K  [RES_0603]
R31  10K  [RES_0603]
R32  10R  [RES_0603]
R33  200k  [RES_0603]
R34  10K  [RES_0603]
R35  10K  [RES_0603]
R36  0R  [RES_0402]
R37  10K  [RES_0603]
R38  10K  [RES_0603]
R39  12K  [RES_0603]
R40  560R  [RES_0603]
R41  560R  [RES_0603]
R42  200k  [RES_0603]
U8  6-Port USB 3.1 Gen 1 Smart Hub  [USB5926C/KD]  (value not drawn)
X1  25MHz  [XTAL_3225]

### Blocks framed on the sheet
USB5926C/KD: C58 C59 R30-R39 R42 U8 X1

### Ports
C_AB0 (bidir, see USB_HUB1 UP PORT0[8B]), C_AB1 (bidir, see USB_HUB1 DN PORT 1_2[7B]), C_AB2 (bidir, see USB_HUB1 DN PORT 1_2[7D]), C_ATTACH0 (bidir, see USB_HUB1 UP PORT0[8B]), C_ATTACH1 (bidir, see USB_HUB1 DN PORT 1_2[7B]), C_ATTACH2 (bidir, see USB_HUB1 DN PORT 1_2[7D]), PRT_CTL1 (bidir, see USB_HUB1 DN PORT 1_2[7B]), PRT_CTL2 (bidir, see USB_HUB1 DN PORT 1_2[7D]), PRT_CTL3 (bidir, see USB_HUB1 DN PORT 3[4A]), PRT_CTL4 (bidir, see USB_HUB1 DN PORT 4[6C]), PRT_CTL5 (bidir, see USB_HUB1 DN PORT 5[1A]), PRT_CTL6 (bidir, see USB_HUB1 DN PORT 6[1A]), SMBus1_SCL (bidir, see MCU[4C]), SMBus1_SDA (bidir, see MCU[4C]), USB2P0_N (bidir, see USB_HUB1 UP PORT0[3B]), USB2P0_P (bidir, see USB_HUB1 UP PORT0[3B]), USB2P1_N (bidir, see USB_HUB1 DN PORT 1_2[2A]), USB2P1_P (bidir, see USB_HUB1 DN PORT 1_2[2A]), USB2P2_N (bidir, see USB_HUB1 DN PORT 1_2[2C]), USB2P2_P (bidir, see USB_HUB1 DN PORT 1_2[2C]), USB2P3_N (bidir, see USB_HUB1 DN PORT 3[1B]), USB2P3_P (bidir, see USB_HUB1 DN PORT 3[1B]), USB2P4_N (bidir, see USB_HUB1 DN PORT 4[2B]), USB2P4_P (bidir, see USB_HUB1 DN PORT 4[2B]), USB2P5_N (bidir, see USB_HUB1 DN PORT 5[3B]), USB2P5_P (bidir, see USB_HUB1 DN PORT 5[3B]), USB2P6_N (bidir, see USB_HUB1 DN PORT 6[1B]), USB2P6_P (bidir, see USB_HUB1 DN PORT 6[1B]), USB3RX3_N (bidir, see USB_HUB1 DN PORT 3[1C]), USB3RX3_P (bidir, see USB_HUB1 DN PORT 3[1C]), USB3RX4_N (bidir, see USB_HUB1 DN PORT 4[1B]), USB3RX4_P (bidir, see USB_HUB1 DN PORT 4[1B]), USB3RX_A0_N (bidir, see USB_HUB1 UP PORT0[3B]), USB3RX_A0_P (bidir, see USB_HUB1 UP PORT0[3B]), USB3RX_A1_N (bidir, see USB_HUB1 DN PORT 1_2[2A]), USB3RX_A1_P (bidir, see USB_HUB1 DN PORT 1_2[2A]), USB3RX_A2_N (bidir, see USB_HUB1 DN PORT 1_2[2C]), USB3RX_A2_P (bidir, see USB_HUB1 DN PORT 1_2[2C]), USB3RX_B0_N (bidir, see USB_HUB1 UP PORT0[3B]), USB3RX_B0_P (bidir, see USB_HUB1 UP PORT0[3B]), USB3RX_B1_N (bidir, see USB_HUB1 DN PORT 1_2[2A]), USB3RX_B1_P (bidir, see USB_HUB1 DN PORT 1_2[2A]), USB3RX_B2_N (bidir, see USB_HUB1 DN PORT 1_2[2C]), USB3RX_B2_P (bidir, see USB_HUB1 DN PORT 1_2[2C]), USB3TX3_N (bidir, see USB_HUB1 DN PORT 3[1B]), USB3TX3_P (bidir, see USB_HUB1 DN PORT 3[1B]), USB3TX4_N (bidir, see USB_HUB1 DN PORT 4[1B]), USB3TX4_P (bidir, see USB_HUB1 DN PORT 4[1B]), USB3TX_A0_N (bidir, see USB_HUB1 UP PORT0[3B]), USB3TX_A0_P (bidir, see USB_HUB1 UP PORT0[3B]), USB3TX_A1_N (bidir, see USB_HUB1 DN PORT 1_2[3A]), USB3TX_A1_P (bidir, see USB_HUB1 DN PORT 1_2[3A]), USB3TX_A2_N (bidir, see USB_HUB1 DN PORT 1_2[3C]), USB3TX_A2_P (bidir, see USB_HUB1 DN PORT 1_2[3C]), USB3TX_B0_N (bidir, see USB_HUB1 UP PORT0[3B]), USB3TX_B0_P (bidir, see USB_HUB1 UP PORT0[3B]), USB3TX_B1_N (bidir, see USB_HUB1 DN PORT 1_2[3A]), USB3TX_B1_P (bidir, see USB_HUB1 DN PORT 1_2[3A]), USB3TX_B2_N (bidir, see USB_HUB1 DN PORT 1_2[3C]), USB3TX_B2_P (bidir, see USB_HUB1 DN PORT 1_2[3C]), USB5926_VBUS_DET (bidir, see USB_HUB1 UP PORT0[4A]), USB5926C_RST (bidir, see MCU[8C], USB_HUB1 DN PORT 1_2[5B], USB_HUB1 DN PORT 1_2[5D], USB_HUB1 DN PORT 5[3D], USB_HUB1 DN PORT 6[1C], USB_HUB1 UP PORT0[5C])

### Nets
+1V2: FB1.1
+3V3: D2.4 D3.4 FB2.1 R30.2 R31.2 R32.2 R34.2 R35.2 R42.2
GND: C37.1 C38.1 C39.1 C40.1 C41.1 C42.1 C43.1 C44.1 C45.1 C46.1 C47.1 C48.1 C49.1 C50.1 C51.1 C52.1 C53.1 C54.1 C55.1 C56.1 C57.1 C58.1 C59.1 D2.2 D3.2 R33.1 R37.2 R38.2 R39.1 U8.23(TESTEN) U8.101(EP) X1.2 X1.4
ALT_MUX_EN: R37.1 U8.63(ALT_MUX_EN/GPIO70)
C_AB0: U8.60(AB0/ATTACHMUX0B/GPIO3) ; port C_AB0
C_AB1: U8.50(AB1/ATTACHMUX1B/GPIO65) ; port C_AB1
C_AB2: U8.71(AB2/ATTACHMUX2B/GPIO66) ; port C_AB2
C_ATTACH0: U8.76(C_ATTACH0/ATTACHMUX0A/GPIO64) ; port C_ATTACH0
C_ATTACH1: U8.73(C_ATTACH1/ATTACHMUX1A/GPIO1) ; port C_ATTACH1
C_ATTACH2: U8.56(C_ATTACH2/ATTACHMUX2A/GPIO2) ; port C_ATTACH2
CC_POL: R38.1 U8.61(CC_POL/GPIO71)
CFG_STRAP: R42.1 U8.20(GPIO12/CFG_STRAP)
HOST_TYPE0: R41.2 U8.53(HOST_TYPE0/GPIO23)
HOST_TYPE0_LED: D3.1 D3.3 R41.1
PRT_CTL1: U8.70(PRT_CTL1/GPIO17) ; port PRT_CTL1
PRT_CTL2: U8.58(PRT_CTL2/GPIO19) ; port PRT_CTL2
PRT_CTL3: U8.52(PRT_CTL3/GPIO21) ; port PRT_CTL3
PRT_CTL4: U8.51(PRT_CTL4/GPIO22) ; port PRT_CTL4
PRT_CTL5: U8.62(PRT_CTL5/GPIO18) ; port PRT_CTL5
PRT_CTL6: U8.57(PRT_CTL6/GANG_PWR/GPIO20) ; port PRT_CTL6
SMBus1_SCL: R34.1 U8.75(SMBCLK/GPIO8) ; port SMBus1_SCL
SMBus1_SDA: R35.1 U8.74(SMBDATA/GPIO6) ; port SMBus1_SDA
SPI_CE: R33.2 U8.68(SPI_CE_N/GPIO7/CFG_NON_REM)
SPI_CLK: R30.1 U8.65(SPI_CLK/GPIO4)
SPI_DI: R32.1 U8.67(SPI_DI/GPIO9/CFG_BC_EN)
SPI_DO: R31.1 U8.66(SPI_DO/GPIO5)
SUSP_IND: R40.2 U8.77(SUSP_IND/GPIO68)
SUSP_IND_LED: D2.1 D2.3 R40.1
USB2P0_N: U8.95(USB2UP_DM) ; port USB2P0_N
USB2P0_P: U8.94(USB2UP_DP) ; port USB2P0_P
USB2P1_N: U8.7(USB2DN_DM1/PRT_DIS_M1) ; port USB2P1_N
USB2P1_P: U8.6(USB2DN_DP1/PRT_DIS_P1) ; port USB2P1_P
USB2P2_N: U8.29(USB2DN_DM2/PRT_DIS_M2) ; port USB2P2_N
USB2P2_P: U8.28(USB2DN_DP2/PRT_DIS_P2) ; port USB2P2_P
USB2P3_N: U8.44(USB2DN_DM3/PRT_DIS_M3) ; port USB2P3_N
USB2P3_P: U8.43(USB2DN_DP3/PRT_DIS_P3) ; port USB2P3_P
USB2P4_N: U8.87(USB2DN_DM4/PRT_DIS_M4) ; port USB2P4_N
USB2P4_P: U8.86(USB2DN_DP4/PRT_DIS_P4) ; port USB2P4_P
USB2P5_N: U8.14(USB2DN_DM5/PRT_DIS_M5) ; port USB2P5_N
USB2P5_P: U8.13(USB2DN_DP5/PRT_DIS_P5) ; port USB2P5_P
USB2P6_N: U8.36(USB2DN_DM6/PRT_DIS_M6) ; port USB2P6_N
USB2P6_P: U8.35(USB2DN_DP6/PRT_DIS_P6) ; port USB2P6_P
USB3RX3_N: U8.49(USB3DN_RXDM3) ; port USB3RX3_N
USB3RX3_P: U8.48(USB3DN_RXDP3) ; port USB3RX3_P
USB3RX4_N: U8.92(USB3DN_RXDM4) ; port USB3RX4_N
USB3RX4_P: U8.91(USB3DN_RXDP4) ; port USB3RX4_P
USB3RX_A0_N: U8.100(USB3UP_RXDMA) ; port USB3RX_A0_N
USB3RX_A0_P: U8.99(USB3UP_RXDPA) ; port USB3RX_A0_P
USB3RX_A1_N: U8.12(USB3DN_RXDM1A) ; port USB3RX_A1_N
USB3RX_A1_P: U8.11(USB3DN_RXDP1A) ; port USB3RX_A1_P
USB3RX_A2_N: U8.34(USB3DN_RXDM2A) ; port USB3RX_A2_N
USB3RX_A2_P: U8.33(USB3DN_RXDP2A) ; port USB3RX_A2_P
USB3RX_B0_N: U8.85(USB3UP_RXDMB) ; port USB3RX_B0_N
USB3RX_B0_P: U8.84(USB3UP_RXDPB) ; port USB3RX_B0_P
USB3RX_B1_N: U8.19(USB3DN_RXDM1B) ; port USB3RX_B1_N
USB3RX_B1_P: U8.18(USB3DN_RXDP1B) ; port USB3RX_B1_P
USB3RX_B2_N: U8.41(USB3DN_RXDM2B) ; port USB3RX_B2_N
USB3RX_B2_P: U8.40(USB3DN_RXDP2B) ; port USB3RX_B2_P
USB3TX3_N: U8.46(USB3DN_TXDM3) ; port USB3TX3_N
USB3TX3_P: U8.45(USB3DN_TXDP3) ; port USB3TX3_P
USB3TX4_N: U8.89(USB3DN_TXDM4) ; port USB3TX4_N
USB3TX4_P: U8.88(USB3DN_TXDP4) ; port USB3TX4_P
USB3TX_A0_N: U8.97(USB3UP_TXDMA) ; port USB3TX_A0_N
USB3TX_A0_P: U8.96(USB3UP_TXDPA) ; port USB3TX_A0_P
USB3TX_A1_N: U8.9(USB3DN_TXDM1A) ; port USB3TX_A1_N
USB3TX_A1_P: U8.8(USB3DN_TXDP1A) ; port USB3TX_A1_P
USB3TX_A2_N: U8.31(USB3DN_TXDM2A) ; port USB3TX_A2_N
USB3TX_A2_P: U8.30(USB3DN_TXDP2A) ; port USB3TX_A2_P
USB3TX_B0_N: U8.82(USB3UP_TXDMB) ; port USB3TX_B0_N
USB3TX_B0_P: U8.81(USB3UP_TXDPB) ; port USB3TX_B0_P
USB3TX_B1_N: U8.16(USB3DN_TXDM1B) ; port USB3TX_B1_N
USB3TX_B1_P: U8.15(USB3DN_TXDP1B) ; port USB3TX_B1_P
USB3TX_B2_N: U8.38(USB3DN_TXDM2B) ; port USB3TX_B2_N
USB3TX_B2_P: U8.37(USB3DN_TXDP2B) ; port USB3TX_B2_P
USB5926_VBUS_DET: U8.24(VBUS_DET) ; port USB5926_VBUS_DET
USB5926C_OSC_IN: C58.2 U8.3(XTALI/CLKIN) X1.3
USB5926C_OSC_OUT: R36.2 U8.4(XTALO)
USB5926C_RBIAS: R39.2 U8.1(RBIAS)
USB5926C_RST: U8.25(RESET_N) ; port USB5926C_RST
VDD12: C37.2 C39.2 C41.2 C43.2 C45.2 C47.2 C49.2 C51.2 C53.2 C55.2 C56.2 C57.2 FB1.2 U8.10(VDD12_1) U8.17(VDD12_2) U8.26(VDD12_3) U8.32(VDD12_4) U8.39(VDD12_5) U8.47(VDD12_6) U8.59(VDD12_7) U8.78(VDD12_8) U8.83(VDD12_9) U8.90(VDD12_10) U8.98(VDD12_11)
VDD33: C38.2 C40.2 C42.2 C44.2 C46.2 C48.2 C50.2 C52.2 C54.2 FB2.2 U8.2(VDD33_1) U8.5(VDD33_2) U8.27(VDD33_3) U8.42(VDD33_4) U8.54(VDD33_5) U8.64(VDD33_6) U8.72(VDD33_7) U8.93(VDD33_8)
NetC59_2: C59.2 R36.1 X1.1

Not connected (* = marked no-connect by the designer): U8 21(NC_1)* 22(NC_2)* 55(HOST_TYPE1/GPIO67)* 69(GPIO69)* 79(NC_3)* 80(NC_4)*

### Notes on the sheet
- DEC CAPACITOR
- LED INDICATOR
- (near D2) Green = Run
  Orange = Suspend
- Blue = USB 3.2
  Yellow = USB 2.0
- USB-C PORT
- (near R32) Ports 1, 2, 3, 4, 5, 6 DCP enabled
- (near R30) Nessuna spi FLASH utlizzo un piccolo Soc in i2c per modificare i registri
- (near R33) All ports are removable
- I2C ADDRESS: 0x2D
- Collega Hub Secondario
- SD CARD READER
- ETHERNET PHY
- (near R42) CONFIG2 SMBus Slave Mode
- RS485 TRANSCEIVER
- (in symbol Title) TITLE; DATE; REVISION; DRAWN BY; PAGE; OF
- (in symbol USB5926C/KD) UPSTREAM PORT USB-C; DOWNSTREAM PORT 1 USB-C; DOWNSTREAM PORT 2 USB-C; DOWNSTREAM PORT 3 USB3; DOWNSTREAM PORT 4 USB3; DOWNSTREAM PORT 5 USB2; DOWNSTREAM PORT 6 USB2

### Library data of the parts
C37 C38 = CAP_0603: Capacitor SMD 0603 [C15849]; Manufacturer: *; Manufacturer Part Number: *; Distributor Link: *; LCSC: *; Rating: *; Dielectric: *
C39-C57 = CAP_0603: Capacitor SMD 0603 [C14663]; Manufacturer: *; Manufacturer Part Number: *; Distributor Link: *; LCSC: *; Rating: *; Dielectric: *
C58 C59 = CAP_0402: Capacitor SMD 0402 [C1549]; Manufacturer: *; Manufacturer Part Number: *; Distributor Link: *; LCSC: *; Rating: *; Dielectric: *
D2 = A-SP1962S1GHC-C01-3T: [C19171293]
D3 = A-SP1962Y3B1C-C01-3T: [C19171299]
FB1 FB2 = FB_0603: Ferrite Bead SMD 0603[C76892]; Manufacturer: *; Manufacturer Part Number: *; Distributor Link: *; LCSC: *
R30 R31 R34 R35 R37 R38 = RES_0603: Resistor SMD 0603[C25804]; Manufacturer: *; Manufacturer Part Number: *; Distributor Link: *; LCSC: *
R32 = RES_0603: Resistor SMD 0603[C22859]; Manufacturer: *; Manufacturer Part Number: *; Distributor Link: *; LCSC: *
R33 R42 = RES_0603: Resistor SMD 0603[C25811]; Manufacturer: *; Manufacturer Part Number: *; Distributor Link: *; LCSC: *
R36 = RES_0402: Resistor SMD 0402 [C17168]; Manufacturer: *; Manufacturer Part Number: *; Distributor Link: *; LCSC: *
R39 = RES_0603: [C22790]; Manufacturer: *; Manufacturer Part Number: *; Distributor Link: *; LCSC: *
R40 R41 = RES_0603: [C23204]; Manufacturer: *; Manufacturer Part Number: *; Distributor Link: *; LCSC: *
U8 = USB5926C/KD: [C3210694]
X1 = TSX-3225_24.0000MF15X-AC: as X4 on sheet MCU

## Sheet USB_HUB1 UP PORT0.SchDoc: USB_HUB 3.0
size A3; DrawnBy: Luca Schenetti; Revision: A; SheetNumber: 5; SheetTotal: 10
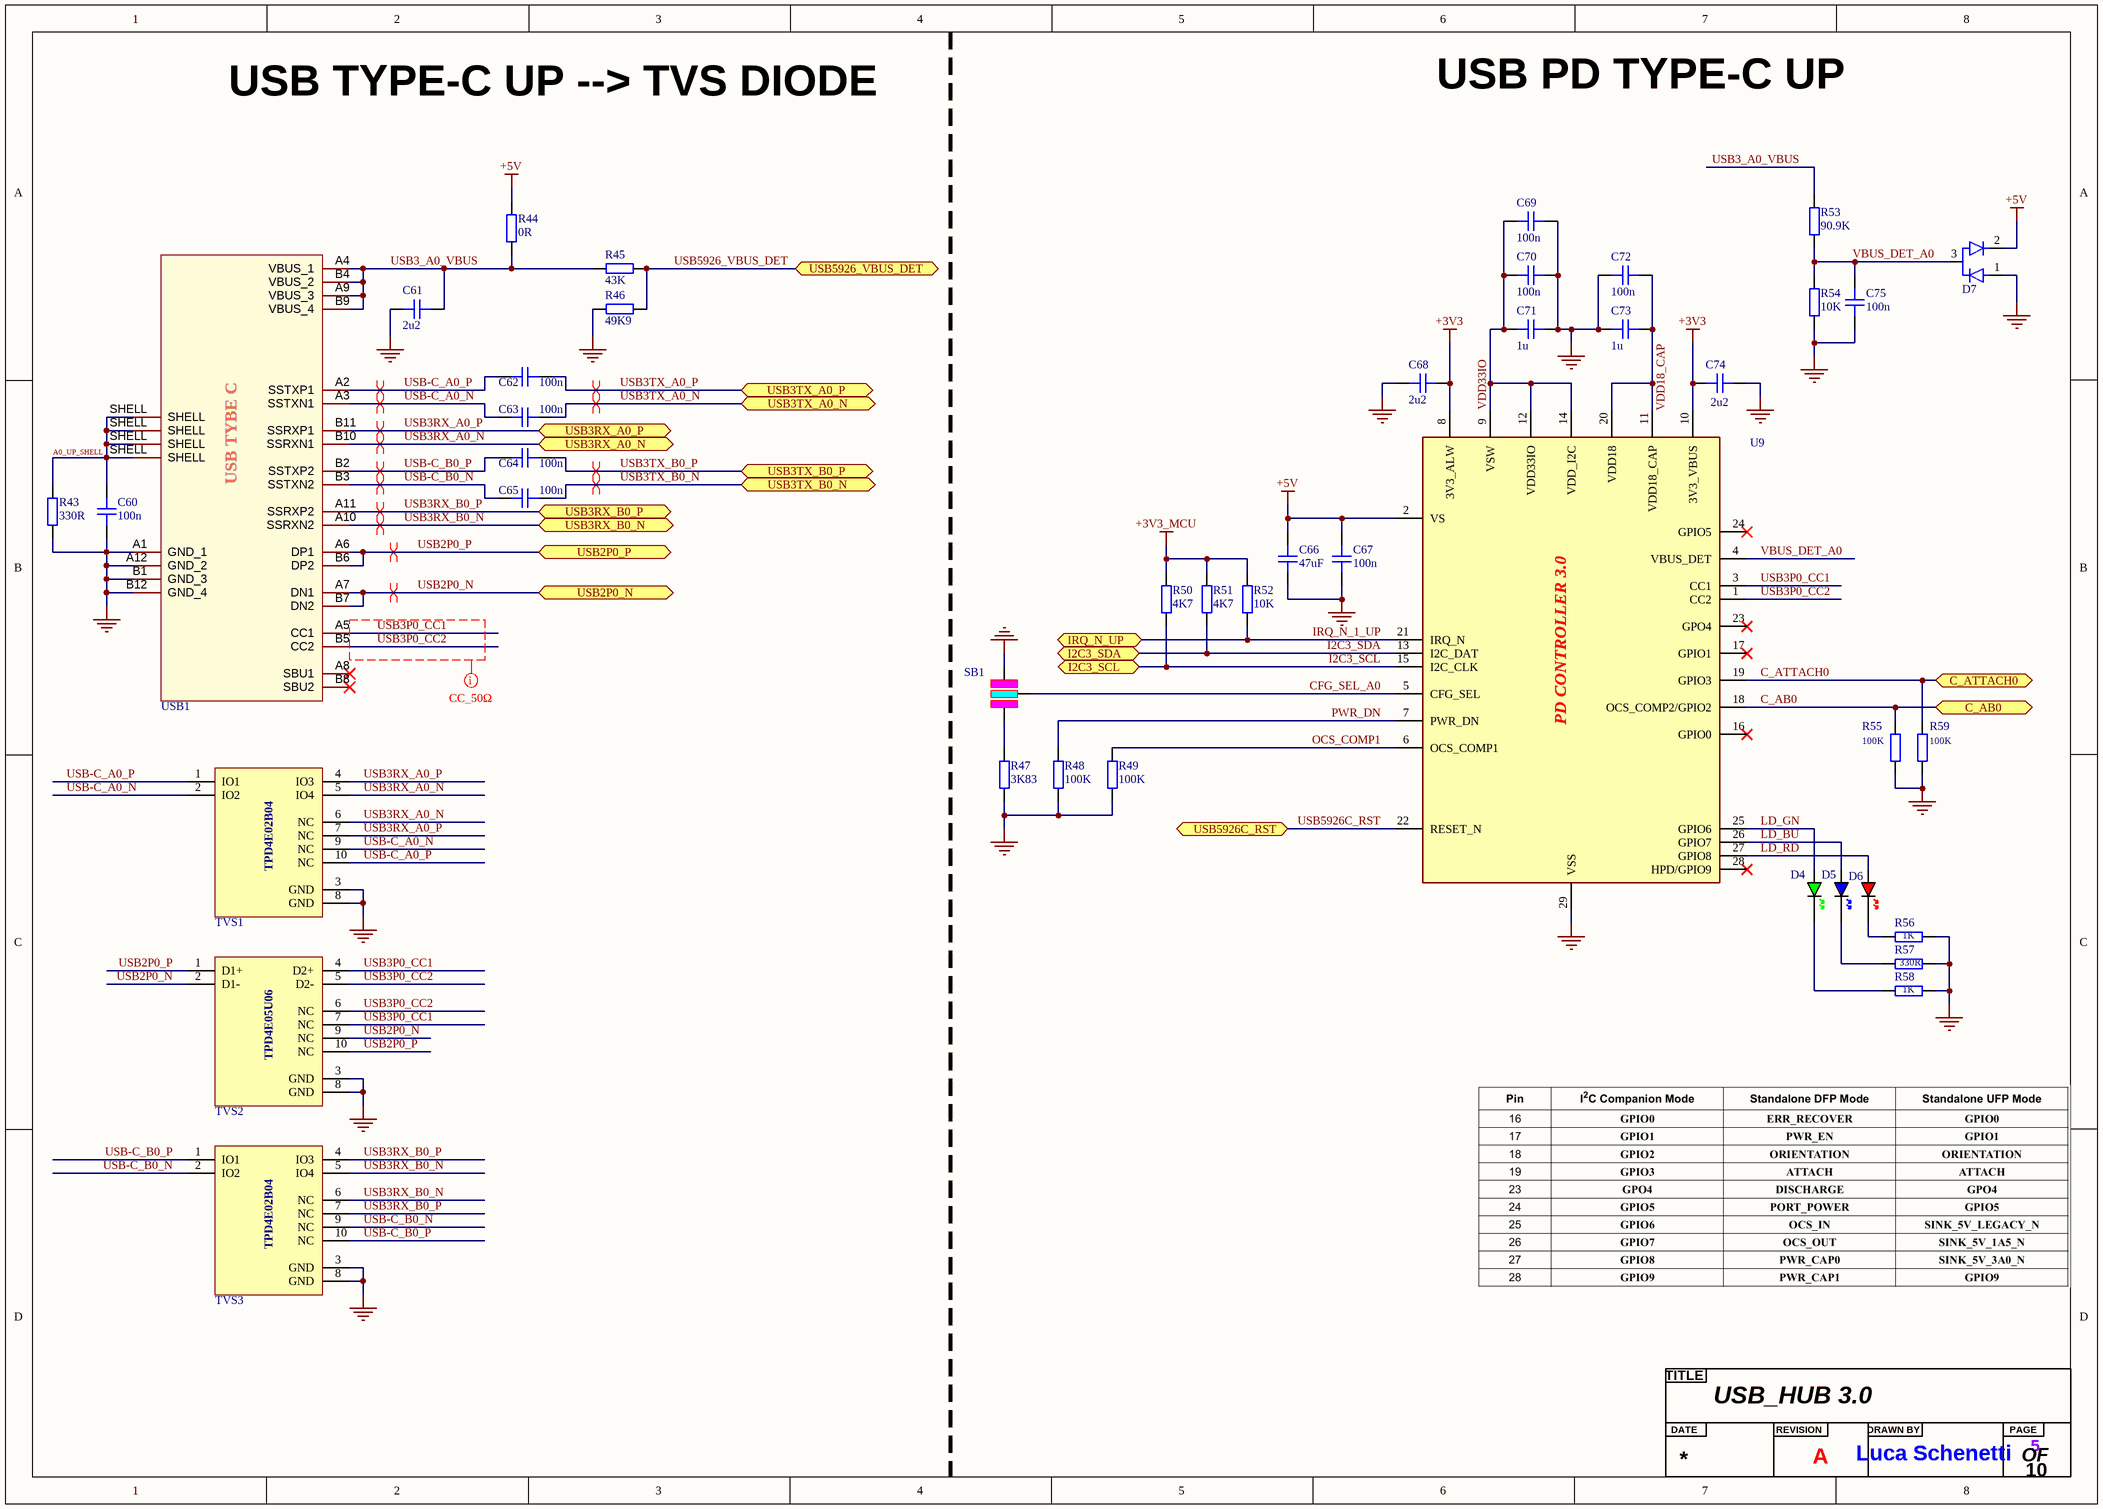
[diagram p8: USB_HUB1 UP PORT0.SchDoc]

### Parts
(Parts that share a designator on the sheet are numbered #1, #2 ... from top to bottom, then left to right.)
?#5  Title  (value not drawn)  (graphical)
C60  100n  [CAP_0603]
C61  2u2  [CAP_0603]
C62  100n  [CAP_0402]
C63  100n  [CAP_0402]
C64  100n  [CAP_0402]
C65  100n  [CAP_0402]
C66  47uF  [CAP_0603]
C67  100n  [CAP_0603]
C68  2u2  [CAP_0603]
C69  100n  [CAP_0603]
C70  100n  [CAP_0603]
C71  1u  [CAP_0603]
C72  100n  [CAP_0603]
C73  1u  [CAP_0603]
C74  2u2  [CAP_0603]
C75  100n  [CAP_0603]
D4  GREEN  [LED_0603_GREEN]  (value not drawn)
D5  BLUE  [LED_0603_BLUE]  (value not drawn)
D6  RED  [LED_0603_RED]  (value not drawn)
D7  High-Speed Switching Diode  [BAV99,215]  (value not drawn)
R43  330R  [RES_0603]
R44  0R  [RES_0603]
R45  43K  [RES_0603]
R46  49K9  [RES_0603]
R47  3K83  [RES_0603]
R48  100K  [RES_0603]
R49  100K  [RES_0603]
R50  4K7  [RES_0603]
R51  4K7  [RES_0603]
R52  10K  [RES_0603]
R53  90.9K  [RES_0603]
R54  10K  [RES_0603]
R55  100K  [RES_0603]
R56  1K  [RES_0603]
R57  330R  [RES_0603]
R58  1K  [RES_0603]
R59  100K  [RES_0603]
SB1  SOLDER BBRIDGE 3W  [SOLDER BRIDBE 3W]  (value not drawn)
TVS1  TVS DIODE USB 3  [TPD4E02B04DQAR]  (value not drawn)
TVS2  ESD and Surge Protection USB, HDMI & High Speed  [TPD4E05U06DQAR]  (value not drawn)
TVS3  TVS DIODE USB 3  [TPD4E02B04DQAR]  (value not drawn)
U9  USB Type-C® PD 3.0 Port Controller  [UPD350AT/Q8X]  (value not drawn)
USB1  TYPE-C 24P QCHT  [TYPE-C 24P QCHT]  (value not drawn)

### Ports
C_AB0 (bidir, see USB_HUB1[3C]), C_ATTACH0 (bidir, see USB_HUB1[3C]), I2C3_SCL (bidir, see MCU[2C], PWR[4B], PWR[11A], USB_HUB1 DN PORT 1_2[5B], USB_HUB1 DN PORT 1_2[5D]), I2C3_SDA (bidir, see MCU[4C], PWR[4B], PWR[11A], USB_HUB1 DN PORT 1_2[5B], USB_HUB1 DN PORT 1_2[5D]), IRQ_N_UP (bidir, see MCU[2C]), USB2P0_N (bidir, see USB_HUB1[3B]), USB2P0_P (bidir, see USB_HUB1[3B]), USB3RX_A0_N (bidir, see USB_HUB1[3B]), USB3RX_A0_P (bidir, see USB_HUB1[3B]), USB3RX_B0_N (bidir, see USB_HUB1[3C]), USB3RX_B0_P (bidir, see USB_HUB1[3C]), USB3TX_A0_N (bidir, see USB_HUB1[3B]), USB3TX_A0_P (bidir, see USB_HUB1[3B]), USB3TX_B0_N (bidir, see USB_HUB1[3C]), USB3TX_B0_P (bidir, see USB_HUB1[3C]), USB5926_VBUS_DET (bidir, see USB_HUB1[3B]), USB5926C_RST (bidir, see MCU[8C], USB_HUB1 DN PORT 1_2[5B], USB_HUB1 DN PORT 1_2[5D], USB_HUB1 DN PORT 5[3D], USB_HUB1 DN PORT 6[1C], USB_HUB1[3C])

### Nets
+3V3: C68.2 C74.2 U9.8(3V3_ALW) U9.10(3V3_VBUS)
+3V3_MCU: R50.2 R51.2 R52.2
+5V: C66.2 C67.2 D7.2 R44.2 U9.2(VS)
GND: C60.1 C61.1 C66.1 C67.1 C68.1 C69.1 C70.1 C71.1 C72.2 C73.1 C74.1 C75.1 D7.1 R43.1 R46.1 R47.1 R48.1 R49.1 R54.1 R55.1 R56.2 R57.2 R58.2 R59.1 SB1.2 TVS1.3(GND) TVS1.8(GND) TVS2.3(GND) TVS2.8(GND) TVS3.3(GND) TVS3.8(GND) U9.29(VSS) USB1.A1(GND_1) USB1.A12(GND_2) USB1.B1(GND_3) USB1.B12(GND_4)
A0_UP_SHELL: C60.2 R43.2 USB1.SHELL
C_AB0: R55.2 U9.18(OCS_COMP2/GPIO2) ; port C_AB0
C_ATTACH0: R59.2 U9.19(GPIO3) ; port C_ATTACH0
CFG_SEL_A0: SB1.1 U9.5(CFG_SEL)
I2C3_SCL: R50.1 U9.15(I2C_CLK) ; port I2C3_SCL
I2C3_SDA: R51.1 U9.13(I2C_DAT) ; port I2C3_SDA
IRQ_N_1_UP: R52.1 U9.21(IRQ_N) ; port IRQ_N_UP
LD_BU: D5.A U9.26(GPIO7)
LD_GN: D4.A U9.25(GPIO6)
LD_RD: D6.A U9.27(GPIO8)
OCS_COMP1: R49.2 U9.6(OCS_COMP1)
PWR_DN: R48.2 U9.7(PWR_DN)
USB2P0_N: TVS2.2(D1-) TVS2.9(NC) USB1.A7(DN1) USB1.B7(DN2) ; port USB2P0_N
USB2P0_P: TVS2.1(D1+) TVS2.10(NC) USB1.A6(DP1) USB1.B6(DP2) ; port USB2P0_P
USB3_A0_VBUS: C61.2 R44.1 R45.1 R53.2 USB1.A4(VBUS_1) USB1.A9(VBUS_3) USB1.B4(VBUS_2) USB1.B9(VBUS_4)
USB3P0_CC1: TVS2.4(D2+) TVS2.7(NC) U9.3(CC1) USB1.A5(CC1)
USB3P0_CC2: TVS2.5(D2-) TVS2.6(NC) U9.1(CC2) USB1.B5(CC2)
USB3RX_A0_N: TVS1.5(IO4) TVS1.6(NC) USB1.B10(SSRXN1) ; port USB3RX_A0_N
USB3RX_A0_P: TVS1.4(IO3) TVS1.7(NC) USB1.B11(SSRXP1) ; port USB3RX_A0_P
USB3RX_B0_N: TVS3.5(IO4) TVS3.6(NC) USB1.A10(SSRXN2) ; port USB3RX_B0_N
USB3RX_B0_P: TVS3.4(IO3) TVS3.7(NC) USB1.A11(SSRXP2) ; port USB3RX_B0_P
USB3TX_A0_N: C63.2 ; port USB3TX_A0_N
USB3TX_A0_P: C62.2 ; port USB3TX_A0_P
USB3TX_B0_N: C65.2 ; port USB3TX_B0_N
USB3TX_B0_P: C64.2 ; port USB3TX_B0_P
USB5926_VBUS_DET: R45.2 R46.2 ; port USB5926_VBUS_DET
USB5926C_RST: U9.22(RESET_N) ; port USB5926C_RST
USB-C_A0_N: C63.1 TVS1.2(IO2) TVS1.9(NC) USB1.A3(SSTXN1)
USB-C_A0_P: C62.1 TVS1.1(IO1) TVS1.10(NC) USB1.A2(SSTXP1)
USB-C_B0_N: C65.1 TVS3.2(IO2) TVS3.9(NC) USB1.B3(SSTXN2)
USB-C_B0_P: C64.1 TVS3.1(IO1) TVS3.10(NC) USB1.B2(SSTXP2)
VBUS_DET_A0: C75.2 D7.3 R53.1 R54.2 U9.4(VBUS_DET)
VDD18_CAP: C72.1 C73.2 U9.11(VDD18_CAP) U9.20(VDD18)
VDD33IO: C69.2 C70.2 C71.2 U9.9(VSW) U9.12(VDD33IO) U9.14(VDD_I2C)
NetD4_K: D4.K R58.1
NetD5_K: D5.K R57.1
NetD6_K: D6.K R56.1
NetR47_2: R47.2 SB1.0

Not connected (* = marked no-connect by the designer): U9 16(GPIO0)* 17(GPIO1)* 23(GPO4)* 24(GPIO5)* 28(HPD/GPIO9)*; USB1 A8(SBU1)* B8(SBU2)*

### Layout directives
differential pair; differential pair class DIFF_USB_90Ω: USB2P0_N, USB2P0_P, USB3RX_A0_N, USB3RX_A0_P, USB3RX_B0_N, USB3RX_B0_P, USB3TX_A0_N, USB3TX_A0_P, USB3TX_B0_N, USB3TX_B0_P, USB-C_A0_N, USB-C_A0_P, USB-C_B0_N, USB-C_B0_P
net class CC_50Ω: USB3P0_CC1, USB3P0_CC2

### Notes on the sheet
- USB TYPE-C UP --> TVS DIODE
- USB PD TYPE-C UP
- (near SB1) Companion Mode
  I2C Slave Address = 1011_111
- I2C Slave Address = 1011_111
  UFP STANDALONE
- (in symbol Title) TITLE; DATE; REVISION; DRAWN BY; PAGE; OF
- (in symbol TPD4E02B04DQAR) TPD4E02B04
- (in symbol TPD4E05U06DQAR) TPD4E05U06
- (in symbol TYPE-C 24P QCHT) USB TYBE C
- (in symbol UPD350AT/Q8X) PD CONTROLLER 3.0

### Library data of the parts
C60 C67 C69 C70 C72 C75 = CAP_0603: Capacitor SMD 0603 [C14663]; Manufacturer: *; Manufacturer Part Number: *; Distributor Link: *; LCSC: *; Rating: *; Dielectric: *
C61 C68 C74 = CAP_0603: Capacitor SMD 0603 [C23630]; Manufacturer: *; Manufacturer Part Number: *; Distributor Link: *; LCSC: *; Rating: *; Dielectric: *
C62-C65 = CAP_0402: Capacitor SMD 0402[C1525]; Manufacturer: *; Manufacturer Part Number: *; Distributor Link: *; LCSC: *; Rating: *; Dielectric: *
C66 = CAP_0603: Capacitor SMD 0603 [C730416]; Manufacturer: *; Manufacturer Part Number: *; Distributor Link: *; LCSC: *; Rating: *; Dielectric: *
C71 C73 = CAP_0603: Capacitor SMD 0603 [C15849]; Manufacturer: *; Manufacturer Part Number: *; Distributor Link: *; LCSC: *; Rating: *; Dielectric: *
D4 = LED_0603_GREEN: [C2986059]
D5 = LED_0603_BLUE: [C84266]
D6 = LED_0603_RED: [C2286]
D7 = BAV99,215: [C2500]
R43 R57 = RES_0603: [C23138]; Manufacturer: *; Manufacturer Part Number: *; Distributor Link: *; LCSC: *
R44 = RES_0603: [C21189]; Manufacturer: *; Manufacturer Part Number: *; Distributor Link: *; LCSC: *
R45 = RES_0603: [C23172]; Manufacturer: *; Manufacturer Part Number: *; Distributor Link: *; LCSC: *
R46 = RES_0603: [C23184]; Manufacturer: *; Manufacturer Part Number: *; Distributor Link: *; LCSC: *
R47 = RES_0603: [C22982]; Manufacturer: *; Manufacturer Part Number: *; Distributor Link: *; LCSC: *
R48 R49 R55 R59 = RES_0603: [C25803]; Manufacturer: *; Manufacturer Part Number: *; Distributor Link: *; LCSC: *
R50 R51 = RES_0603: Resistor SMD 0603[C23162]; Manufacturer: *; Manufacturer Part Number: *; Distributor Link: *; LCSC: *
R52 = RES_0603: Resistor SMD 0603[C25804]; Manufacturer: *; Manufacturer Part Number: *; Distributor Link: *; LCSC: *
R53 = RES_0603: [C23129]; Manufacturer: *; Manufacturer Part Number: *; Distributor Link: *; LCSC: *
R54 = RES_0603: [C25804]; Manufacturer: *; Manufacturer Part Number: *; Distributor Link: *; LCSC: *
R56 R58 = RES_0603: [C21190]; Manufacturer: *; Manufacturer Part Number: *; Distributor Link: *; LCSC: *
TVS1 TVS3 = TPD4E02B04DQAR: [C106794]
TVS2 = TPD4E05U06DQAR: [C138714]
U9 = UPD350AT/Q8X: [C622602]
USB1 = TYPE-C 24P QCHT: [C456013]